# EAGLE design mb_01 (EAGLE 7.7.0)

## Sheet 1 of 6
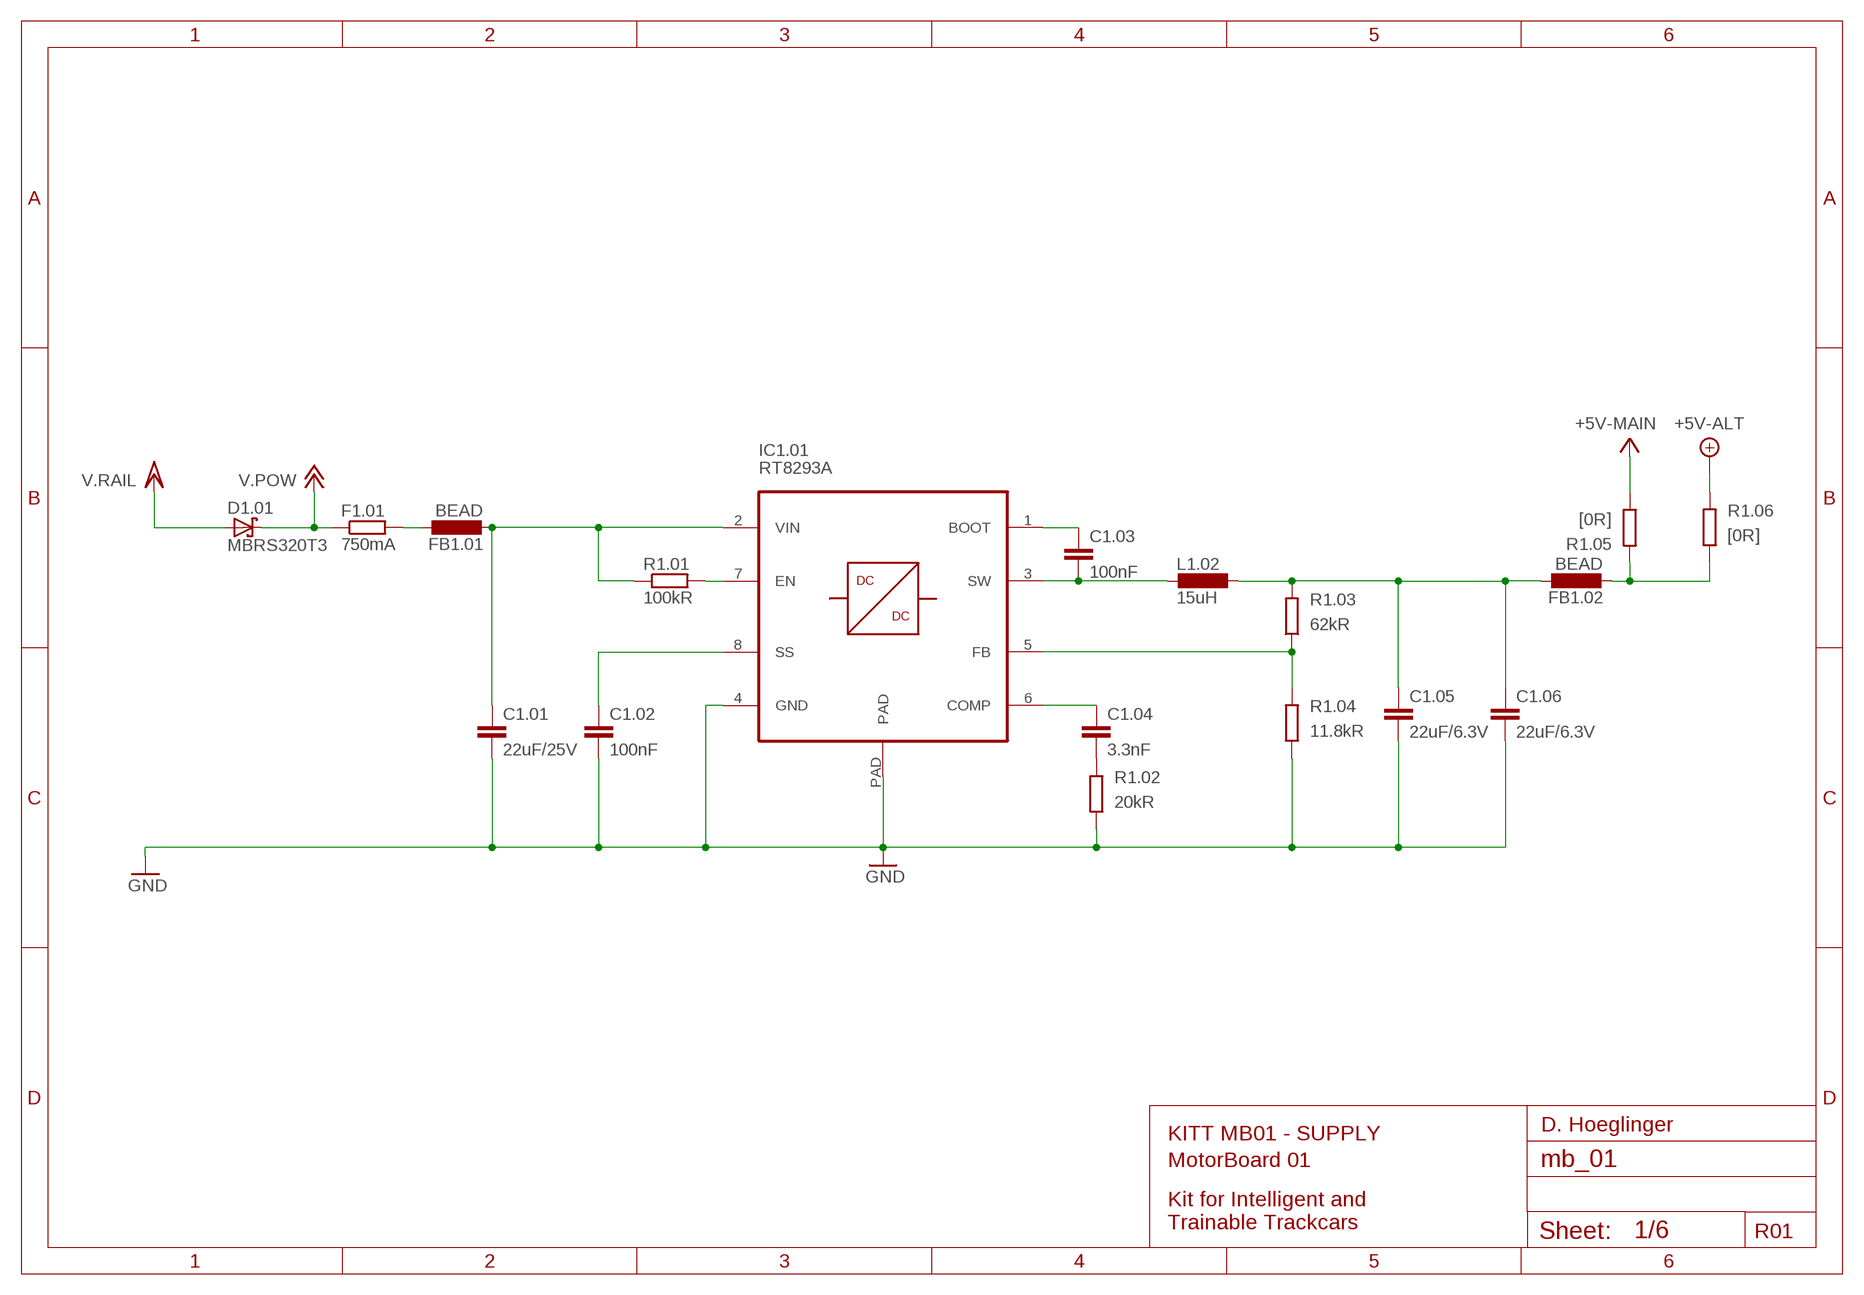
[diagram p0: schematic, sheet 1]

### Parts
C1.01  22uF/25V  C-EUC1210K  [C1210K]
C1.02  100nF  C-EUC0402K  [C0402K]
C1.03  100nF  C-EUC0402K  [C0402K]
C1.04  3.3nF  C-EUC0402K  [C0402K]
C1.05  22uF/6.3V  C-EUC1206K  [C1206K]
C1.06  22uF/6.3V  C-EUC1206K  [C1206K]
D1.01  MBRS320T3  [SMC]
F1.01  750mA  R-EU_R1210  [R1210]
FB1.01  BEAD  L-EUL4516C  [L4516C]
FB1.02  BEAD  L-EUL4516C  [L4516C]
IC1.01  RT8293A  [SOIC-8-PAD]
L1.02  15uH  NRS8030XX  [TAIYO-YUDEN.NRS8030T4R7MJGJ]
R1.01  100kR  R-EU_R0402  [R0402]
R1.02  20kR  R-EU_R0402  [R0402]
R1.03  62kR  R-EU_R0402  [R0402]
R1.04  11.8kR  R-EU_R0402  [R0402]
R1.05  [0R]  R-EU_R0402  [R0402]
R1.06  [0R]  R-EU_R0402  [R0402]

### Nets
+5V: R1.05.1 R1.06.2 ; supply symbol labelled +5V-MAIN, +5V-ALT ; also sheet 2,4,6
+12V: D1.01.C F1.01.1 ; supply symbol labelled V.POW ; also sheet 4,5
GND: C1.01.2 C1.02.2 C1.05.2 C1.06.2 IC1.01.4(GND) IC1.01.PAD R1.02.1 R1.04.1 ; also sheet 2,3,4,5,6
N$80: F1.01.2 FB1.01.1
N$81: C1.01.1 FB1.01.2 IC1.01.2(VIN) R1.01.1
N$82: IC1.01.7(EN) R1.01.2
N$83: C1.02.1 IC1.01.8(SS)
N$84: C1.04.2 R1.02.2
N$85: C1.04.1 IC1.01.6(COMP)
N$86: IC1.01.5(FB) R1.03.1 R1.04.2
N$87: C1.05.1 C1.06.1 FB1.02.1 L1.02.1 R1.03.2
N$88: C1.03.2 IC1.01.3(SW) L1.02.2
N$89: C1.03.1 IC1.01.1(BOOT)
N$90: FB1.02.2 R1.05.2 R1.06.1
VCC/2: D1.01.A ; supply symbol labelled V.RAIL ; also sheet 4

### Notes on the sheet
- TODO
- TODO
- TODO
- TODO
- TODO
- TODO
- D. Hoeglinger
- KITT MB01 | - SUPPLY
- MotorBoard 01
- Kit for Intelligent and
  Trainable Trackcars
- R01

## Sheet 2 of 6
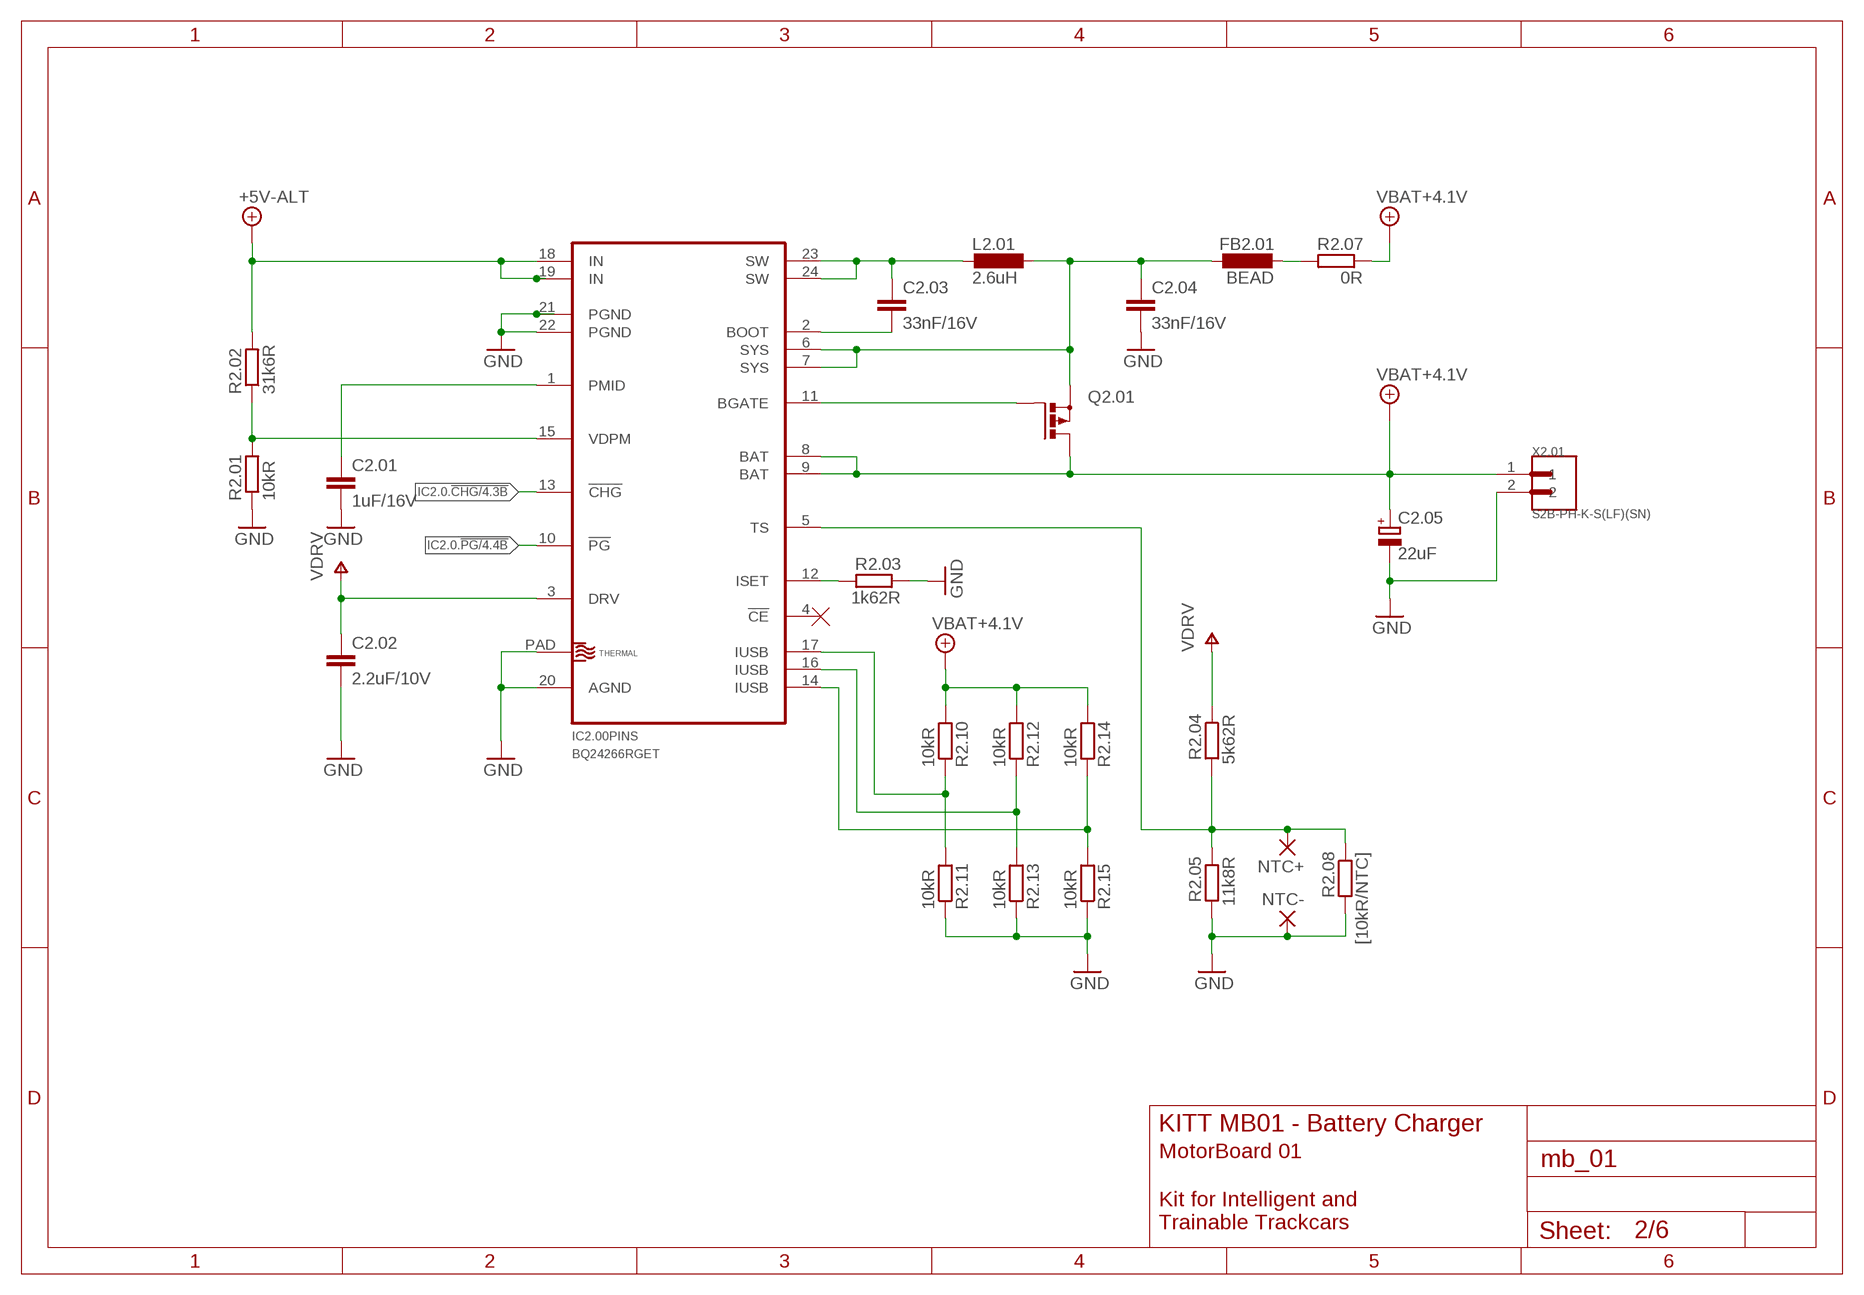
[diagram p1: schematic, sheet 2]

### Parts
C2.01  1uF/16V  C-EUC0805  [C0805]
C2.02  2.2uF/10V  C-EUC0603K  [C0603K]
C2.03  33nF/16V  C-EUC0603  [C0603]
C2.04  33nF/16V  C-EUC0805  [C0805]
C2.05  22uF  CPOL-EUA/3216-18R  [A/3216-18R]
FB2.01  BEAD  L-EUL4516C  [L4516C]
IC2.00  BQ24266RGET  [VQFN-24]
L2.01  2.6uH  NRS8030XX  [TAIYO-YUDEN.NRS8030T4R7MJGJ]
NTC+  SMD2  [SMD1,27-2,54]
NTC-  SMD2  [SMD1,27-2,54]
Q2.01  P-MOSFET-SO8  [SO-08]
R2.01  10kR  R-EU_R0402  [R0402]
R2.02  31k6R  R-EU_R0402  [R0402]
R2.03  1k62R  R-EU_R0402  [R0402]
R2.04  5k62R  R-EU_R0402  [R0402]
R2.05  11k8R  R-EU_R0402  [R0402]
R2.07  0R  R-EU_R0402  [R0402]
R2.08  [10kR/NTC]  R-EU_R0402  [R0402]
R2.10  10kR  R-EU_R0402  [R0402]
R2.11  10kR  R-EU_R0402  [R0402]
R2.12  10kR  R-EU_R0402  [R0402]
R2.13  10kR  R-EU_R0402  [R0402]
R2.14  10kR  R-EU_R0402  [R0402]
R2.15  10kR  R-EU_R0402  [R0402]
X2.01  S2B-PH-K-S(LF)(SN)  [JST_S2B-PH-K-S(LF)(SN)]

### Nets
+4.1V: C2.05.+ IC2.00.8(PINS:BAT) IC2.00.9(PINS:BAT) Q2.01.5(D) Q2.01.6(D) Q2.01.7(D) Q2.01.8(D) R2.07.1 R2.10.2 R2.12.2 R2.14.2 X2.01.1 ; supply symbol labelled VBAT+4.1V ; also sheet 6
+5V: IC2.00.18(PINS:IN) IC2.00.19(PINS:IN) R2.02.2 ; supply symbol labelled +5V-ALT ; also sheet 1,4,6
GND: C2.01.2 C2.02.2 C2.04.2 C2.05.- IC2.00.20(PINS:AGND) IC2.00.21(PINS:PGND) IC2.00.22(PINS:PGND) IC2.00.PAD(PAD:THERMAL) NTC-.1(P) R2.01.1 R2.03.1 R2.05.2 R2.08.2 R2.11.1 R2.13.1 R2.15.1 X2.01.2 ; also sheet 1,3,4,5,6
IC2.0.!CHG: IC2.00.13(PINS:!CHG) ; also sheet 4
IC2.0.!PG: IC2.00.10(PINS:!PG) ; also sheet 4
N$8: C2.01.1 IC2.00.1(PINS:PMID)
N$11: IC2.00.15(PINS:VDPM) R2.01.2 R2.02.1
N$12: C2.03.1 IC2.00.23(PINS:SW) IC2.00.24(PINS:SW) L2.01.2
N$13: C2.03.2 IC2.00.2(PINS:BOOT)
N$14: IC2.00.11(PINS:BGATE) Q2.01.4(G)
N$15: IC2.00.5(PINS:TS) NTC+.1(P) R2.04.2 R2.05.1 R2.08.1
N$16: FB2.01.2 R2.07.2
N$18: C2.04.1 FB2.01.1 IC2.00.6(PINS:SYS) IC2.00.7(PINS:SYS) L2.01.1 Q2.01.1(S) Q2.01.2(S) Q2.01.3(S)
N$19: IC2.00.12(PINS:ISET) R2.03.2
N$20: IC2.00.17(PINS:IUSB) R2.10.1 R2.11.2
N$21: IC2.00.16(PINS:IUSB) R2.12.1 R2.13.2
N$22: IC2.00.14(PINS:IUSB) R2.14.1 R2.15.2
V+: C2.02.1 IC2.00.3(PINS:DRV) R2.04.1 ; supply symbol labelled VDRV
Unconnected: IC2.00.4(PINS:!CE)

### Notes on the sheet
- KITT MB01 - Battery Charger
- MotorBoard 01
- Kit for Intelligent and
  Trainable Trackcars

## Sheet 3 of 6
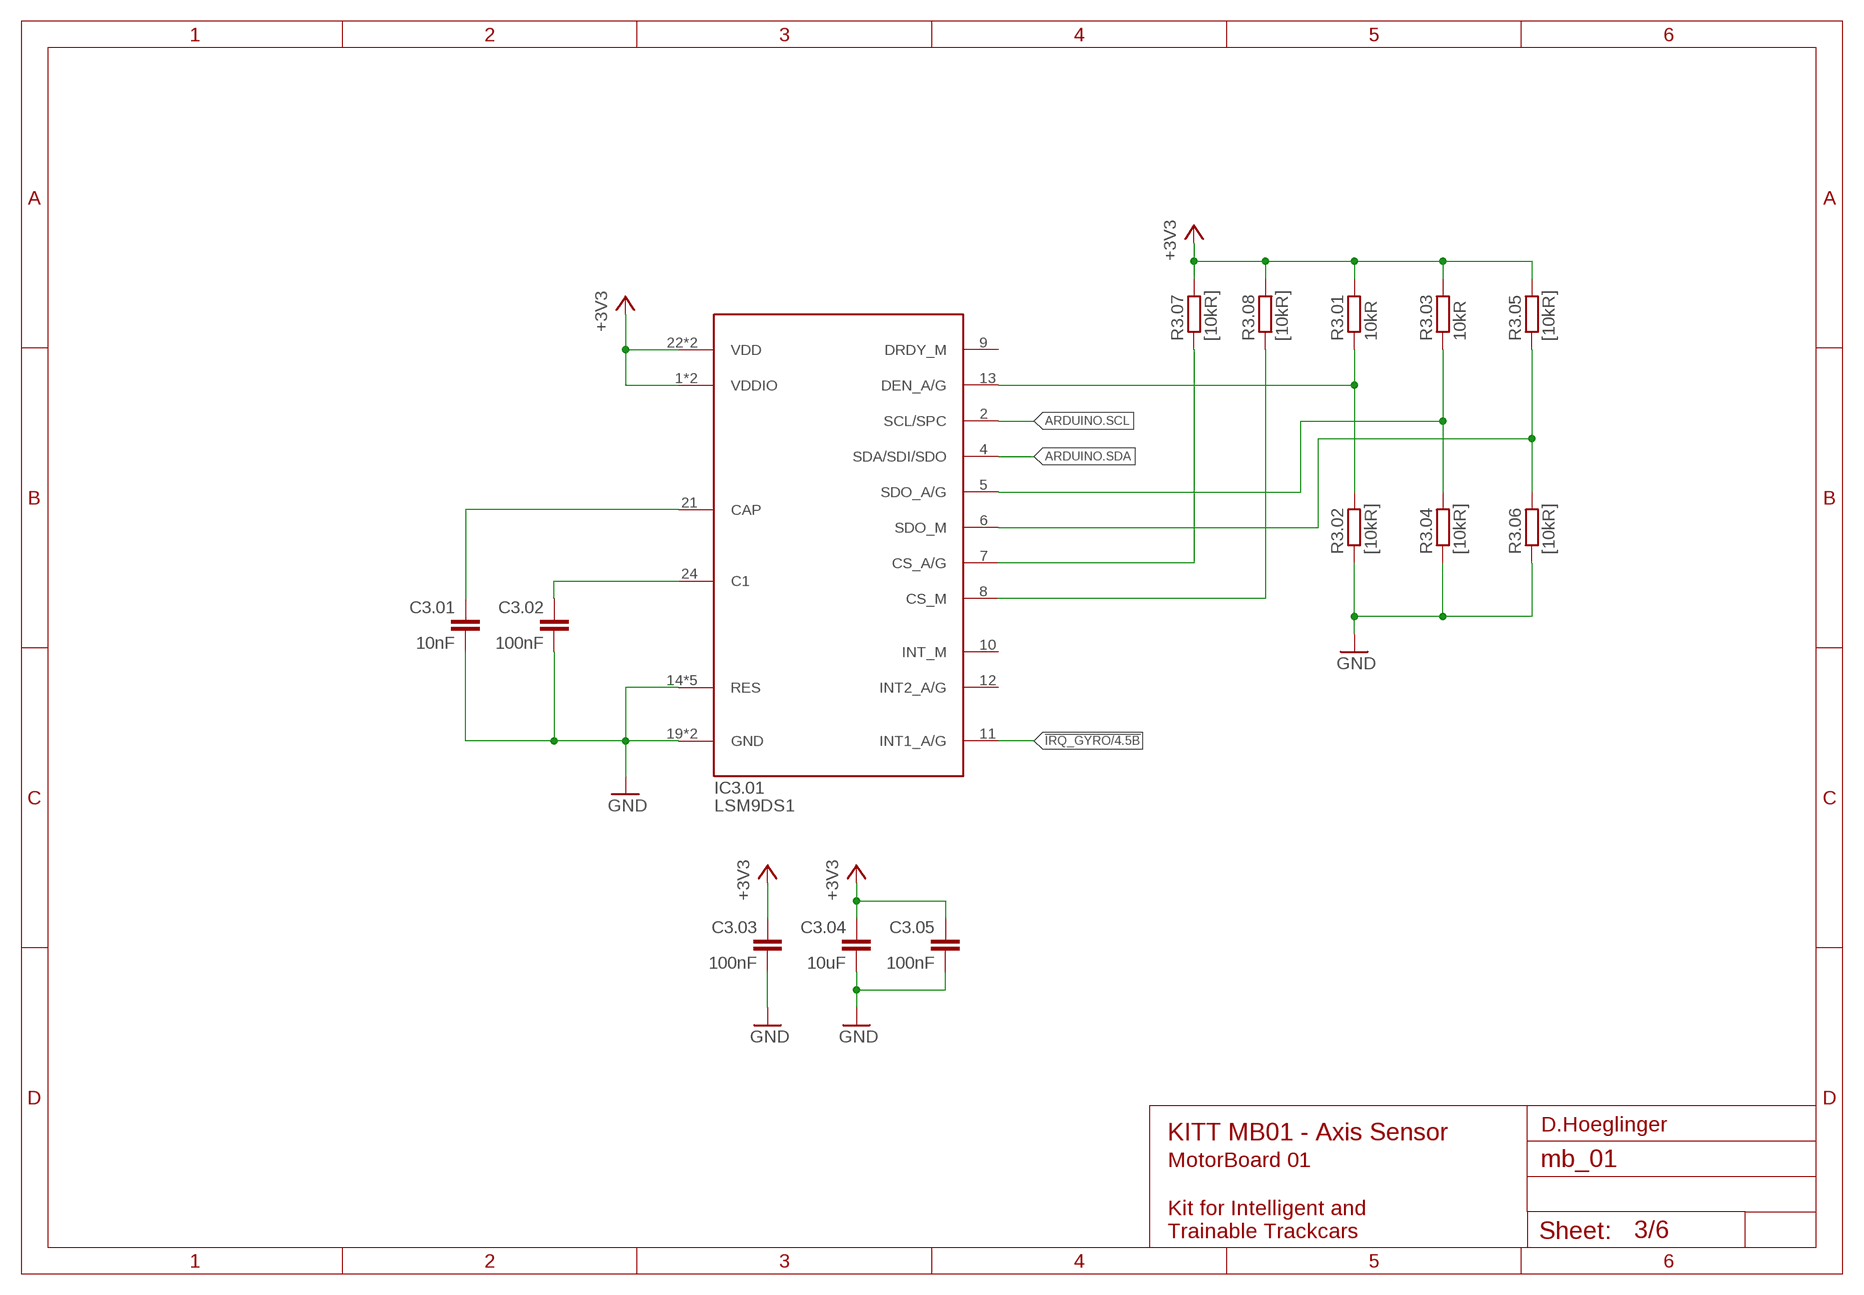
[diagram p2: schematic, sheet 3]

### Parts
C3.01  10nF  C-EUC0603  [C0603]
C3.02  100nF  C-EUC0402  [C0402]
C3.03  100nF  C-EUC0402  [C0402]
C3.04  10uF  C-EUC0603K  [C0603K]
C3.05  100nF  C-EUC0402  [C0402]
IC3.01  LSM9DS1  [LGA-24]
R3.01  10kR  R-EU_R0402  [R0402]
R3.02  [10kR]  R-EU_R0402  [R0402]
R3.03  10kR  R-EU_R0402  [R0402]
R3.04  [10kR]  R-EU_R0402  [R0402]
R3.05  [10kR]  R-EU_R0402  [R0402]
R3.06  [10kR]  R-EU_R0402  [R0402]
R3.07  [10kR]  R-EU_R0402  [R0402]
R3.08  [10kR]  R-EU_R0402  [R0402]

### Nets
!IRQ_GYRO: IC3.01.11(INT1_A/G) ; also sheet 4
+3V3: C3.03.1 C3.04.1 C3.05.1 IC3.01.1(VDDIO) IC3.01.3(VDDIO) IC3.01.22(VDD) IC3.01.23(VDD) R3.01.2 R3.03.2 R3.05.2 R3.07.2 R3.08.2 ; also sheet 4,6
ARDUINO.SCL: IC3.01.2(SCL/SPC)
ARDUINO.SDA: IC3.01.4(SDA/SDI/SDO)
GND: C3.01.2 C3.02.2 C3.03.2 C3.04.2 C3.05.2 IC3.01.14(RES) IC3.01.15(RES) IC3.01.16(RES) IC3.01.17(RES) IC3.01.18(RES) IC3.01.19(GND) IC3.01.20(GND) R3.02.1 R3.04.1 R3.06.1 ; also sheet 1,2,4,5,6
N$1: C3.01.1 IC3.01.21(CAP)
N$6: C3.02.1 IC3.01.24(C1)
N$17: IC3.01.13(DEN_A/G) R3.01.1 R3.02.2
N$23: IC3.01.5(SDO_A/G) R3.03.1 R3.04.2
N$24: IC3.01.7(CS_A/G) R3.07.1
N$26: IC3.01.6(SDO_M) R3.05.1 R3.06.2
N$27: IC3.01.8(CS_M) R3.08.1
Unconnected: IC3.01.9(DRDY_M) IC3.01.10(INT_M) IC3.01.12(INT2_A/G)

### Notes on the sheet
- D.Hoeglinger
- KITT MB01 - Axis Sensor
- MotorBoard 01
- Kit for Intelligent and
  Trainable Trackcars

## Sheet 4 of 6
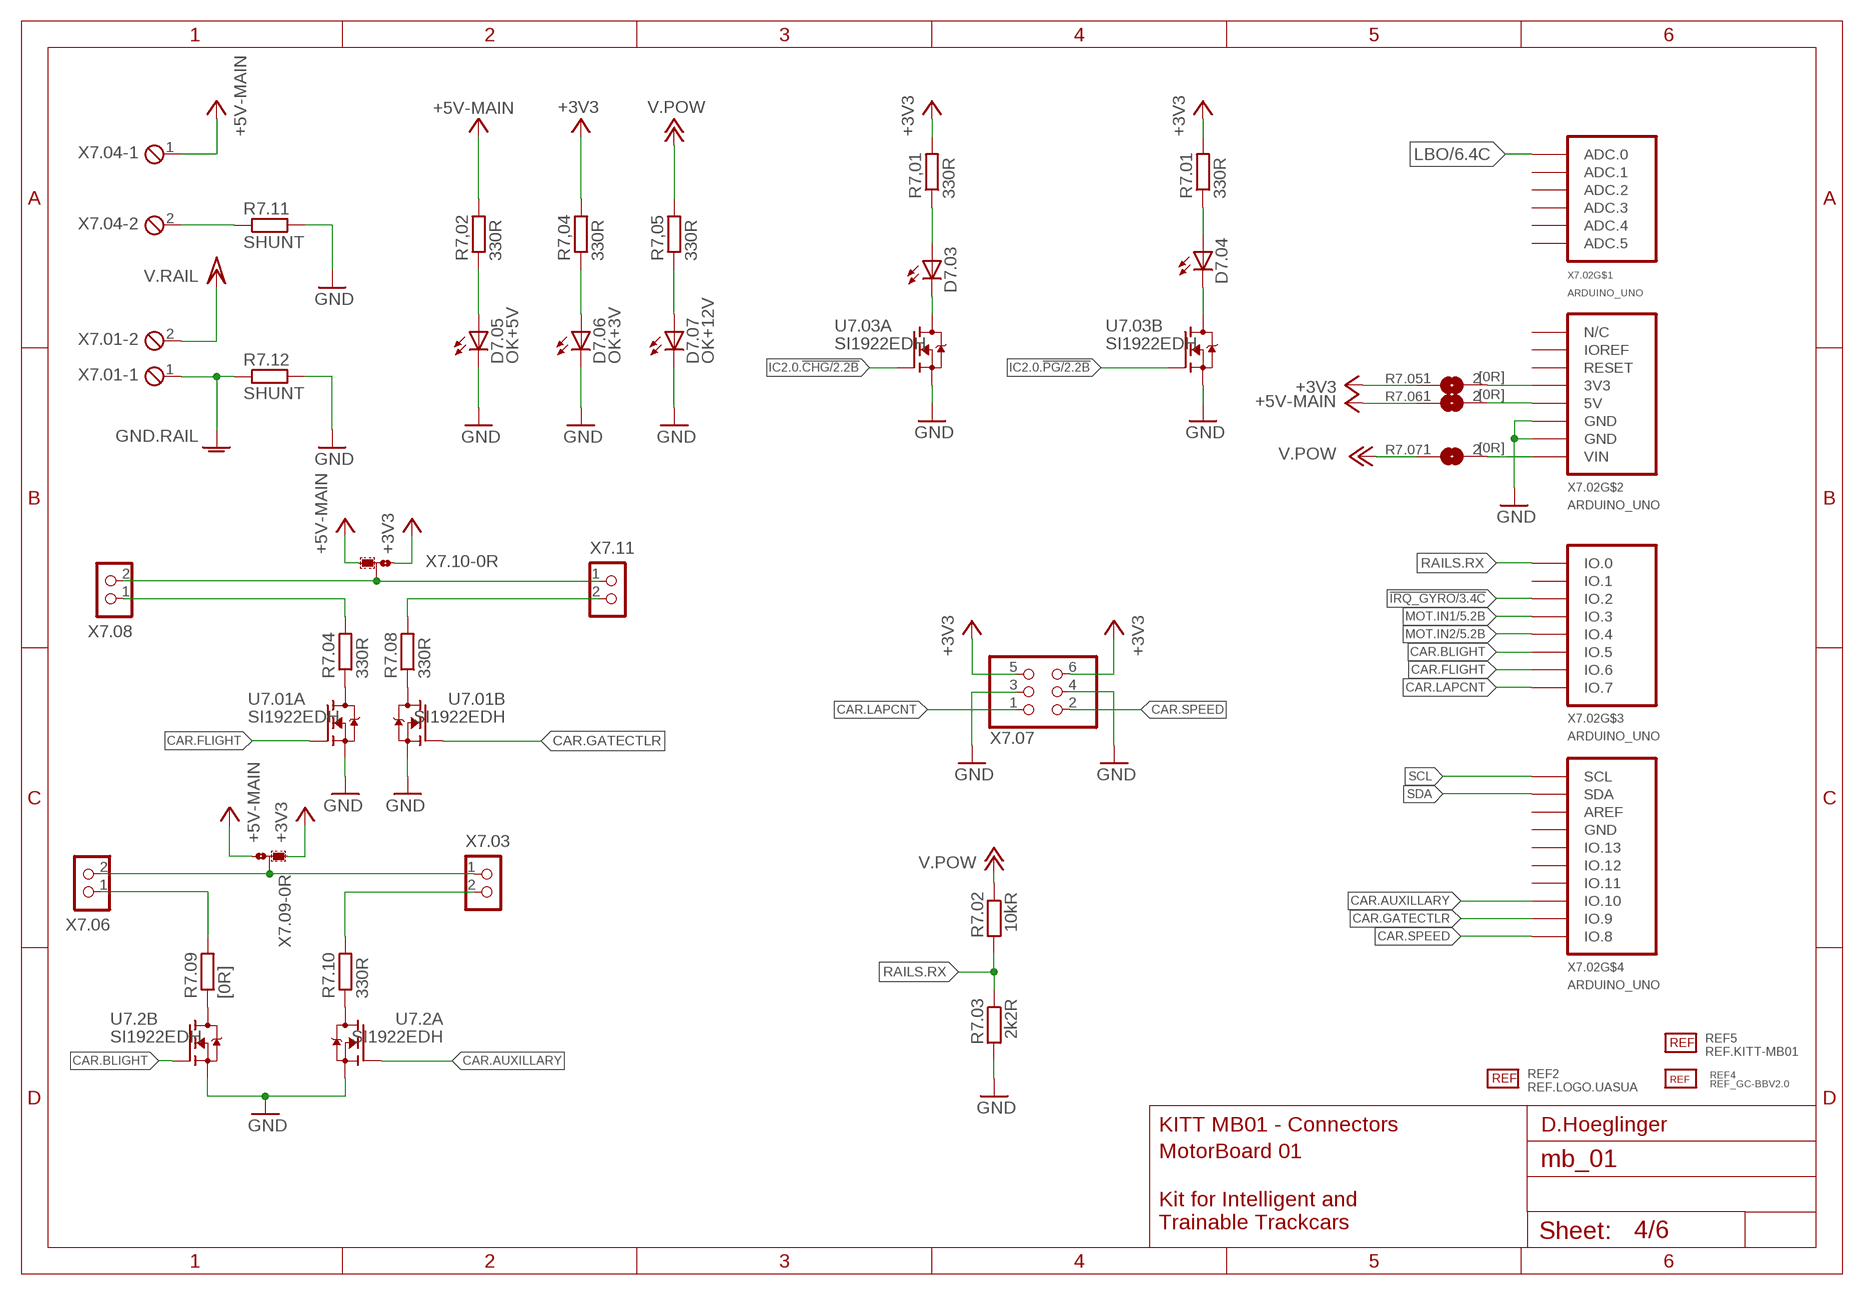
[diagram p3: schematic, sheet 4]

### Parts
D7.03  LEDCHIPLED_1206  [CHIPLED_1206]
D7.04  LEDCHIPLED_1206  [CHIPLED_1206]
D7.05  OK+5V  LEDCHIPLED_1206  [CHIPLED_1206]
D7.06  OK+3V  LEDCHIPLED_1206  [CHIPLED_1206]
D7.07  OK+12V  LEDCHIPLED_1206  [CHIPLED_1206]
R7,01  330R  R-EU_R0603  [R0603]
R7,02  330R  R-EU_R0603  [R0603]
R7,04  330R  R-EU_R0603  [R0603]
R7,05  330R  R-EU_R0603  [R0603]
R7.01  330R  R-EU_R0603  [R0603]
R7.02  10kR  R-EU_M0805  [M0805]
R7.03  2k2R  R-EU_M0805  [M0805]
R7.04  330R  R-EU_R0603  [R0603]
R7.05  [0R]  SJ  [SJ]
R7.06  [0R]  SJ  [SJ]
R7.07  [0R]  SJ  [SJ]
R7.08  330R  R-EU_R0603  [R0603]
R7.09  [0R]  R-EU_R0603  [R0603]
R7.10  330R  R-EU_R0603  [R0603]
R7.11  SHUNT  R-EU_R1206  [R1206]
R7.12  SHUNT  R-EU_R1206  [R1206]
REF2  REF.LOGO.UASUA  [REF_LOGO_UASUA]
REF4  REF_GC-BBV2.0  [REF_GHOSTCAR]
REF5  REF.KITT-MB01  [REF_KITT_MB01]
U7.01  SI1922EDH  [SC70-6]
U7.2  SI1922EDH  [SC70-6]
U7.03  SI1922EDH  [SC70-6]
X7.01  MPT2  [2POL254]
X7.02  ARDUINO_UNO  [AU_PINS]
X7.03  CON_HEADER_1X02  [M1X2_MALE_RIGHT_ANGLED_SMD]
X7.04  MPT2  [2POL254]
X7.06  CON_HEADER_1X02  [M1X2_MALE_RIGHT_ANGLED_SMD]
X7.07  PINHD-2X3/90  [2X03/90]
X7.08  CON_HEADER_1X02  [M1X2_MALE_RIGHT_ANGLED_SMD]
X7.09  0R-JUMPA  [A0R-JMP]
X7.10  0R-JUMPA  [A0R-JMP]
X7.11  CON_HEADER_1X02  [M1X2_MALE_RIGHT_ANGLED_SMD]

### Nets
!IRQ_GYRO: X7.02.IO.2 ; also sheet 3
+3V3: R7,01.2 R7,04.2 R7.01.2 R7.05.1 X7.07.5 X7.07.6 X7.09.1 X7.10.1 ; also sheet 3,6
+5V: R7,02.2 R7.06.1 X7.04.1 X7.09.3 X7.10.3 ; supply symbol labelled +5V-MAIN ; also sheet 1,2,6
+12V: R7,05.2 R7.02.1 R7.07.1 ; supply symbol labelled V.POW ; also sheet 1,5
CAR.AUXILLARY: U7.2.2(A:G) X7.02.IO.10
CAR.BLIGHT: U7.2.5(B:G) X7.02.IO.5
CAR.FLIGHT: U7.01.2(A:G) X7.02.IO.6
CAR.GATECTLR: U7.01.5(B:G) X7.02.IO.9
CAR.LAPCNT: X7.02.IO.7 X7.07.1
CAR.SPEED: X7.02.IO.8 X7.07.2
GND: D7.05.C D7.06.C D7.07.C R7.03.2 R7.11.2 R7.12.2 U7.01.1(A:S) U7.01.4(B:S) U7.2.1(A:S) U7.2.4(B:S) U7.03.1(A:S) U7.03.4(B:S) X7.02.GND2(GND) X7.02.GND3(GND) X7.07.3 X7.07.4 ; also sheet 1,2,3,5,6
GNDA: R7.12.1 X7.01.1 ; supply symbol labelled GND.RAIL
IC2.0.!CHG: U7.03.2(A:G) ; also sheet 2
IC2.0.!PG: U7.03.5(B:G) ; also sheet 2
LBO: X7.02.ADC.0 ; also sheet 6
MOT.IN1: X7.02.IO.3 ; also sheet 5
MOT.IN2: X7.02.IO.4 ; also sheet 5
N$2: R7.04.1 U7.01.6(A:D)
N$3: R7.05.2 X7.02.3.3V(3V3)
N$4: R7.06.2 X7.02.5V
N$5: R7.07.2 X7.02.VIN
N$7: R7.08.1 U7.01.3(B:D)
N$25: R7.11.1 X7.04.2
N$28: D7.03.C U7.03.6(A:D)
N$29: D7.03.A R7,01.1
N$30: D7.04.A R7.01.1
N$31: D7.04.C U7.03.3(B:D)
N$32: D7.05.A R7,02.1
N$38: D7.06.A R7,04.1
N$42: R7.04.2 X7.08.1
N$44: D7.07.A R7,05.1
N$45: X7.08.2 X7.10.2 X7.11.1
N$46: R7.09.2 X7.06.1
N$47: R7.09.1 U7.2.3(B:D)
N$48: X7.03.1 X7.06.2 X7.09.2
N$50: R7.08.2 X7.11.2
N$51: R7.10.1 U7.2.6(A:D)
N$52: R7.10.2 X7.03.2
RAILS.RX: R7.02.2 R7.03.1 X7.02.IO.0
SCL: X7.02.SCL
SDA: X7.02.SDA
VCC/2: X7.01.2 ; supply symbol labelled V.RAIL ; also sheet 1
Unconnected: X7.02.ADC.1 X7.02.ADC.2 X7.02.ADC.3 X7.02.ADC.4 X7.02.ADC.5 X7.02.AREF X7.02.GND.1(GND) X7.02.I/OREF(IOREF) X7.02.IO.1 X7.02.IO.11 X7.02.IO.12 X7.02.IO.13 X7.02.N/C X7.02.RESET

### Notes on the sheet
- KITT MB01 - Connectors | D.Hoeglinger
- MotorBoard 01
- Kit for Intelligent and
  Trainable Trackcars

## Sheet 5 of 6
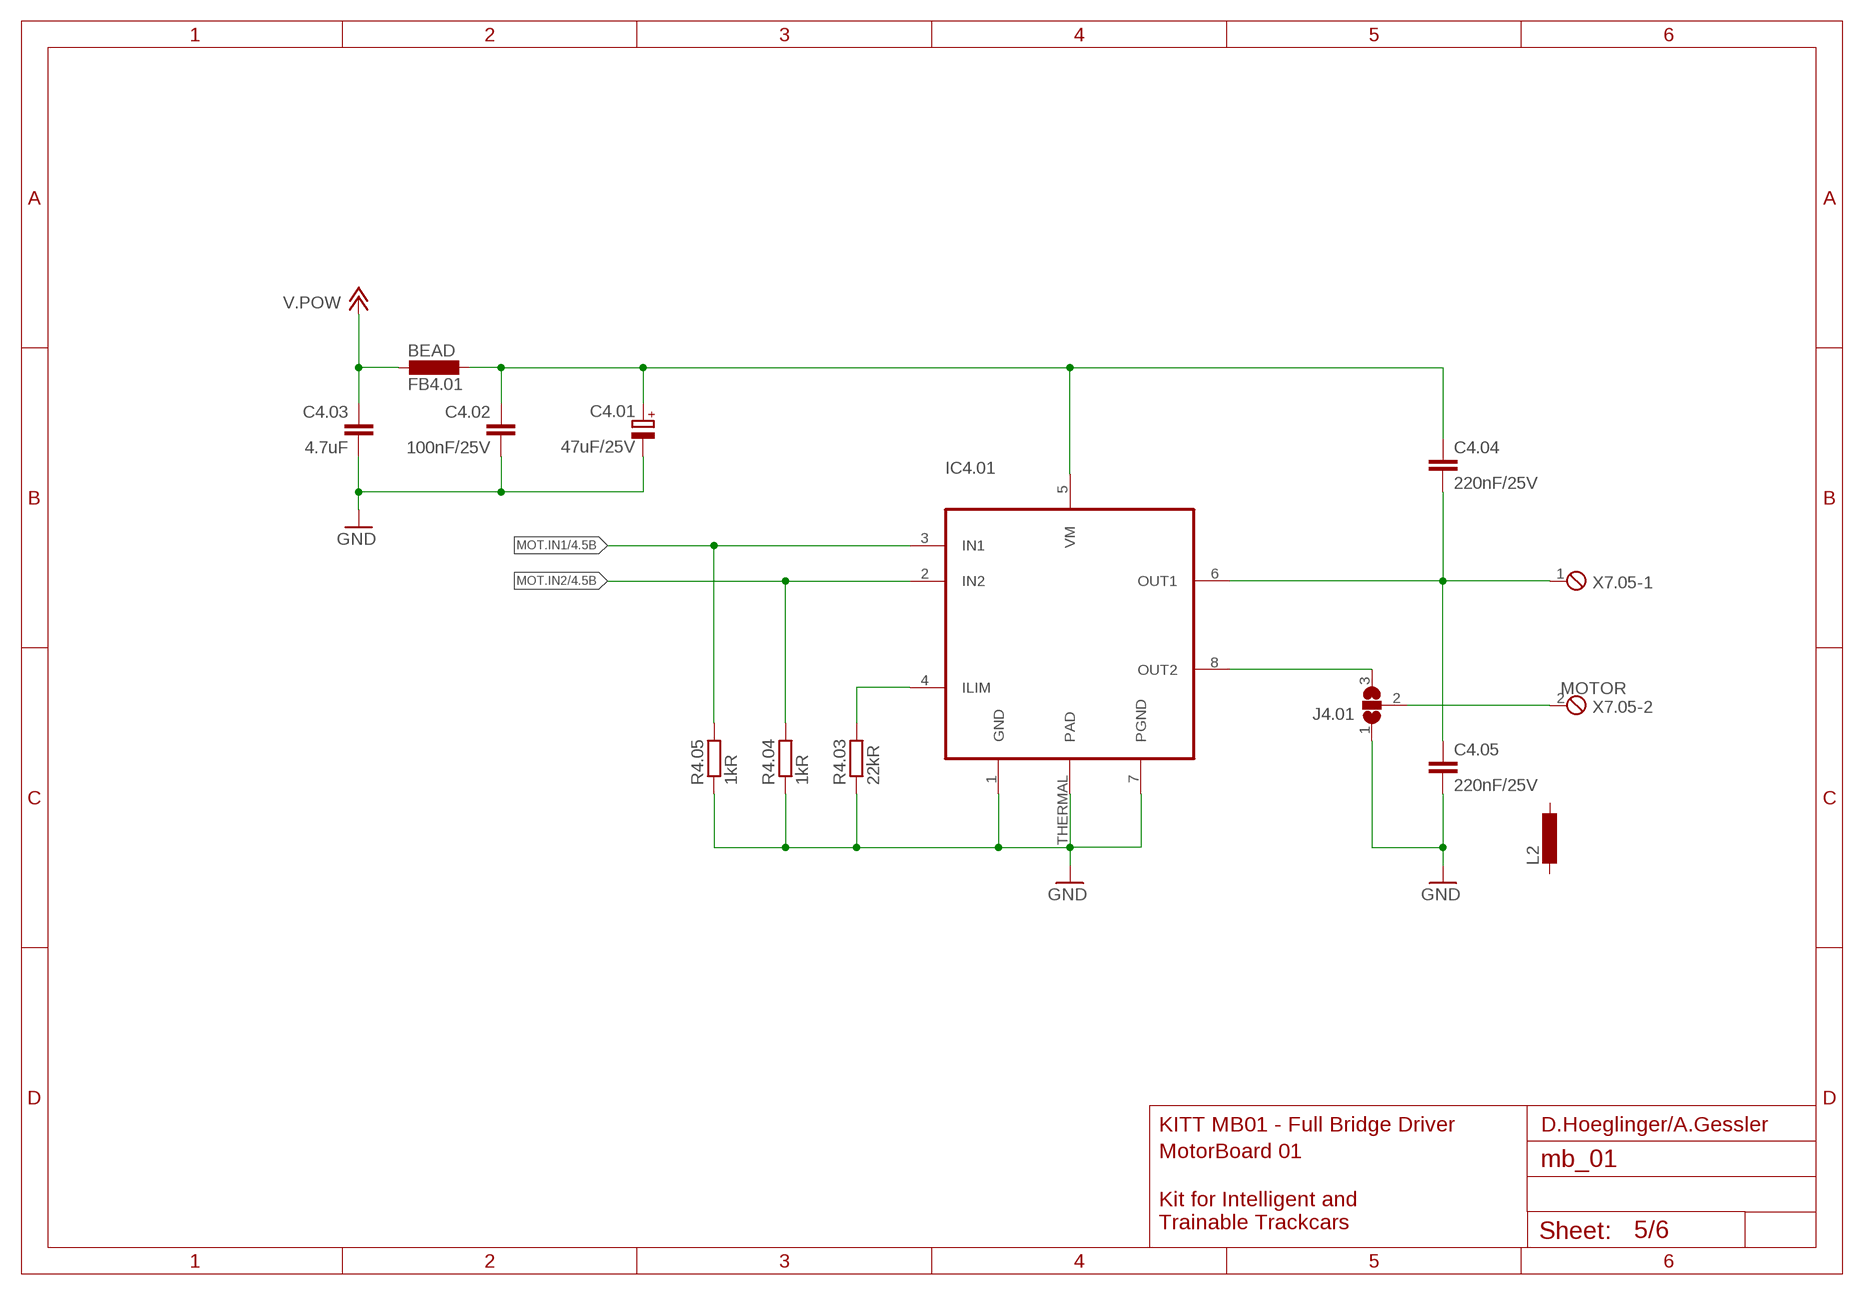
[diagram p4: schematic, sheet 5]

### Parts
C4.01  47uF/25V  CPOL-EUC/6032-28R  [C/6032-28R]
C4.02  100nF/25V  C-EUC0603K  [C0603K]
C4.03  4.7uF  C-EUC0805K  [C0805K]
C4.04  220nF/25V  C-EUC0603K  [C0603K]
C4.05  220nF/25V  C-EUC0603K  [C0603K]
FB4.01  BEAD  L-EUL4516C  [L4516C]
IC4.01  DRV8871  [HSOP8]
J4.01  SJ2W  [SJ_2]
L2  L-EUL4516C  [L4516C]
R4.03  22kR  R-EU_R0402  [R0402]
R4.04  1kR  R-EU_R0402  [R0402]
R4.05  1kR  R-EU_R0402  [R0402]
X7.05  MOTOR  MPT2  [2POL254]

### Nets
+12V: C4.03.1 FB4.01.2 ; supply symbol labelled V.POW ; also sheet 1,4
GND: C4.01.- C4.02.2 C4.03.2 C4.05.2 IC4.01.1(GND) IC4.01.7(PGND) IC4.01.THERMAL(PAD) J4.01.1 R4.03.1 R4.04.1 R4.05.1 ; also sheet 1,2,3,4,6
MOT.IN1: IC4.01.3(IN1) R4.05.2 ; also sheet 4
MOT.IN2: IC4.01.2(IN2) R4.04.2 ; also sheet 4
N$9: J4.01.2 X7.05.2
N$10: C4.01.+ C4.02.1 C4.04.1 FB4.01.1 IC4.01.5(VM)
N$33: C4.04.2 C4.05.1 IC4.01.6(OUT1) X7.05.1
N$34: IC4.01.8(OUT2) J4.01.3
N$35: IC4.01.4(ILIM) R4.03.2
Unconnected: L2.1 L2.2

### Notes on the sheet
- KITT MB01 - Full Bridge Driver | D.Hoeglinger/A.Gessler
- MotorBoard 01
- Kit for Intelligent and
  Trainable Trackcars

## Sheet 6 of 6
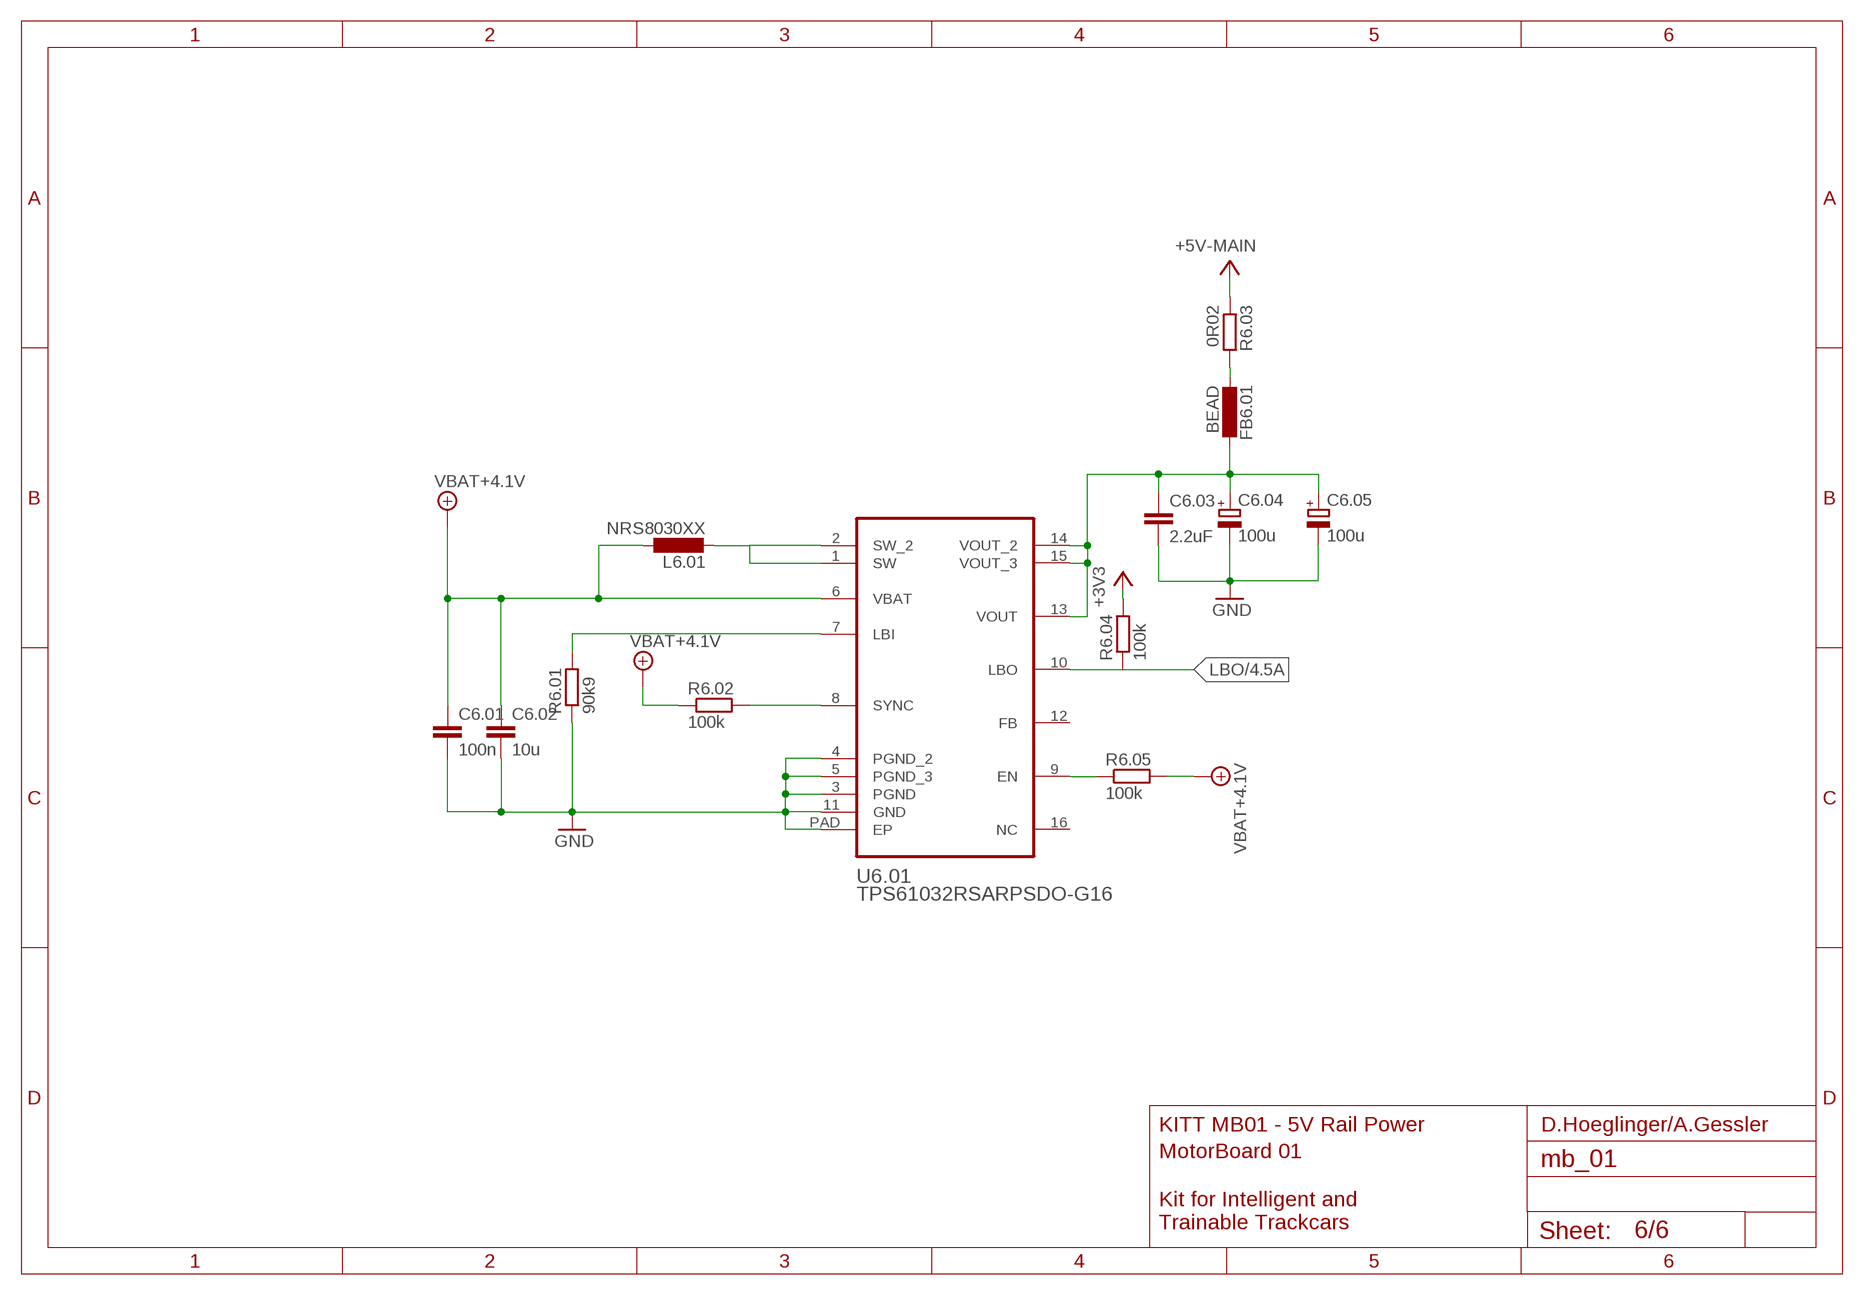
[diagram p5: schematic, sheet 6]

### Parts
C6.01  100n  C-EUC0402  [C0402]
C6.02  10u  C-EUC0603  [C0603]
C6.03  2.2uF  C-EUC0603  [C0603]
C6.04  100u  CPOL-29172312  [C-2312]
C6.05  100u  CPOL-29172312  [C-2312]
FB6.01  BEAD  L-EUL4516C  [L4516C]
L6.01  NRS8030XX  [TAIYO-YUDEN.NRS8030T4R7MJGJ]
R6.01  90k9  R-EU_R0402  [R0402]
R6.02  100k  R-EU_R0402  [R0402]
R6.03  0R02  R-EU_R0805  [R0805]
R6.04  100k  R-EU_R0402  [R0402]
R6.05  100k  R-EU_R0402  [R0402]
U6.01  TPS61032RSARPSDO-G16  [R-PDSO-G16]

### Nets
+3V3: R6.04.2 ; also sheet 3,4
+4.1V: C6.01.1 C6.02.1 L6.01.1 R6.02.1 R6.05.2 U6.01.6(VBAT) ; supply symbol labelled VBAT+4.1V ; also sheet 2
+5V: R6.03.1 ; supply symbol labelled +5V-MAIN ; also sheet 1,2,4
GND: C6.01.2 C6.02.2 C6.03.2 C6.04.N(-) C6.05.N(-) R6.01.1 U6.01.3(PGND) U6.01.4(PGND_2) U6.01.5(PGND_3) U6.01.11(GND) U6.01.PAD(EP) ; also sheet 1,2,3,4,5
LBO: R6.04.1 U6.01.10(LBO) ; also sheet 4
N$36: FB6.01.2 R6.03.2
N$37: R6.05.1 U6.01.9(EN)
N$39: L6.01.2 U6.01.1(SW) U6.01.2(SW_2)
N$40: R6.01.2 U6.01.7(LBI)
N$41: R6.02.2 U6.01.8(SYNC)
N$43: C6.03.1 C6.04.P(+) C6.05.P(+) FB6.01.1 U6.01.13(VOUT) U6.01.14(VOUT_2) U6.01.15(VOUT_3)
Unconnected: U6.01.12(FB) U6.01.16(NC)

### Notes on the sheet
- KITT MB01 - 5V Rail Power | D.Hoeglinger/A.Gessler
- MotorBoard 01
- Kit for Intelligent and
  Trainable Trackcars

## Library data of the parts
C1.01-C1.06 C2.01-C2.04 C3.01-C3.03 C3.05 C4.04 C4.05 C6.01-C6.03 = rcl:C-EU: CAPACITOR, European symbol
C2.05 C4.01 = rcl:CPOL-EU: POLARIZED CAPACITOR, European symbol
C3.04 C4.02 C4.03 = resistor:C-EU: CAPACITOR, European symbol
C6.04 C6.05 = kitt.psvs:CPOL-2917
D1.01 = diode:MBRS3*0T3: SCHOTTKY BARRIER RECTIFIER 3.0 AMPERES 20, 30, 40 VOLT Source: MBRS340T3-D.pdf
D7.03-D7.07 = led:LED: LED OSRAM: - CHIPLED LG R971, LG N971, LY N971, LG Q971, LY Q971, LO R971, LY R971 LH N974, LH R974 LS Q976, LO Q976, LY Q976 LO Q996 - Hyper CHIPLED LW Q18S LB Q993, LB Q99A, LB R99A - SideLED LS A670, LO A670, LY A670, LG A670, LP A670 LB A673, LV A673, LT A673, LW A673 LH A674 LY A675 LS A676, LA A676, LO A676, LY A676, LW A676 LS A679, LY A679, LG A679 - Hyper Micro SIDELED® LS Y876, LA Y876, LO Y876, LY Y876 LT Y87S - SmartLED LW L88C, LW L88S LB L89C, LB L89S, LG L890 LS L89K, LO L89K, LY L89K LS L896, LA L896, LO L896, LY L896 - TOPLED LS T670, LO T670, LY T670, LG T670, LP T670 LSG T670, LSP T670, LSY T670, LOP T670, LYG T670 LG T671, LOG T671, LSG T671 LB T673, LV T673, LT T673, LW T673 LH T674 LS T676, LA T676, LO T676, LY T676, LB T676, LH T676, LSB T676, LW T676 LB T67C, LV T67C, LT T67C, LS T67K, LO T67K, LY T67K, LW E67C LS E67B, LA E67B, LO E67B, LY E67B, LB E67C, LV E67C, LT E67C LW T67C LS T679, LY T679, LG T679 LS T770, LO T770, LY T770, LG T770, LP T770 LB T773, LV T773, LT T773, LW T773 LH T774 LS E675, LA E675, LY E675, LS T675 LS T776, LA T776, LO T776, LY T776, LB T776 LHGB T686 LT T68C, LB T68C - Hyper Mini TOPLED® LB M676 - Mini TOPLED Santana® LG M470 LS M47K, LO M47K, LY M47K Source: http://www.osram.convergy.de LUXEON: - LUMILED® LXK2-PW12-R00, LXK2-PW12-S00, LXK2-PW14-U00, LXK2-PW14-V00 LXK2-PM12-R00, LXK2-PM12-S00, LXK2-PM14-U00 LXK2-PE12-Q00, LXK2-PE12-R00, LXK2-PE12-S00, LXK2-PE14-T00, LXK2-PE14-U00 LXK2-PB12-K00, LXK2-PB12-L00, LXK2-PB12-M00, LXK2-PB14-N00, LXK2-PB14-P00, LXK2-PB14-Q00 LXK2-PR12-L00, LXK2-PR12-M00, LXK2-PR14-Q00, LXK2-PR14-R00 LXK2-PD12-Q00, LXK2-PD12-R00, LXK2-PD12-S00 LXK2-PH12-R00, LXK2-PH12-S00 LXK2-PL12-P00, LXK2-PL12-Q00, LXK2-PL12-R00 Source: www.luxeon.com KINGBRIGHT: KA-3528ASYC Source: www.kingbright.com
F1.01 R1.01-R1.06 R2.01-R2.05 R2.07 R2.08 R2.10-R2.15 R3.01-R3.08 R6.01-R6.05 R7,01 R7,02 R7,04 R7,05 R7.01-R7.04 R7.08 R7.09 R7.10-R7.12 = rcl:R-EU_: RESISTOR, European symbol
FB1.01 FB1.02 FB2.01 FB4.01 FB6.01 L2 = rcl:L-EU: INDUCTOR, European symbol
IC1.01 = kitt.ic:RT8293A
IC2.00 = kitt.ic:BQ24266RGET
IC3.01 = kitt.ic:LSM9DS1; AVAILABILITY: Unavailable; DESCRIPTION: iNEMO inertial module: 3D accelerometer, 3D gyroscope, 3D magnetometer; MF: STMicroelectronics; MP: LSM9DS1; PACKAGE: None; PRICE: None
IC4.01 = kitt.ic:DRV8871
J4.01 = jumper:SJ2W: SMD solder JUMPER
L1.02 L2.01 L6.01 = kitt.psvs:NRS8030XX
NTC+ NTC- = wirepad:SMD2: SMD PAD
Q2.01 = transistor-power:P-MOSFET-SO8: P-Channel MOSFET Example: FDS4435A; P-Channel Logic Level PowerTrench® MOSFET FDS4465; P-Channel 1.8V Specified PowerTrench® MOSFET Source: www.fairchildsemi.com
R4.03-R4.05 = resistor:R-EU_: RESISTOR, European symbol
R7.05-R7.07 = jumper:SJ: SMD solder JUMPER
REF2 = kitt.refs:REF.LOGO.UASUA
REF4 = kitt.con:REF_GC-BBV2.0
REF5 = kitt.refs:REF.KITT-MB01
U6.01 = kitt.ic:TPS61032RSAR: SYNCHRONOUS BOOST CONVERTER
U7.01 U7.2 U7.03 = kitt.ic:SI1922EDH
X2.01 = kitt.con:S2B-PH-K-S(LF)(SN): PH Series 2 Position 2.0 mm Through Hole Side Entry Shrouded Header; AVAILABILITY: Good; DESCRIPTION: PH Series 2 Position 2.0 mm Through Hole Side Entry Shrouded Header; MF: JST; MP: S2B-PH-K-S(LF)(SN); PACKAGE: FakePackage u; PRICE: 0.08 USD
X7.01 X7.04 X7.05 = con-phoenix-254:MPT2: PHOENIX CONNECTOR; OC_FARNELL: unknown; OC_NEWARK: unknown
X7.02 = kitt.con:ARDUINO_UNO
X7.03 X7.06 X7.08 X7.11 = kitt.con:CON_HEADER_1X02
X7.07 = pinhead:PINHD-2X3: PIN HEADER
X7.09 X7.10 = jump-0r-smd:0R-JUMP: SMD 0R 0805 Jumper

## Board
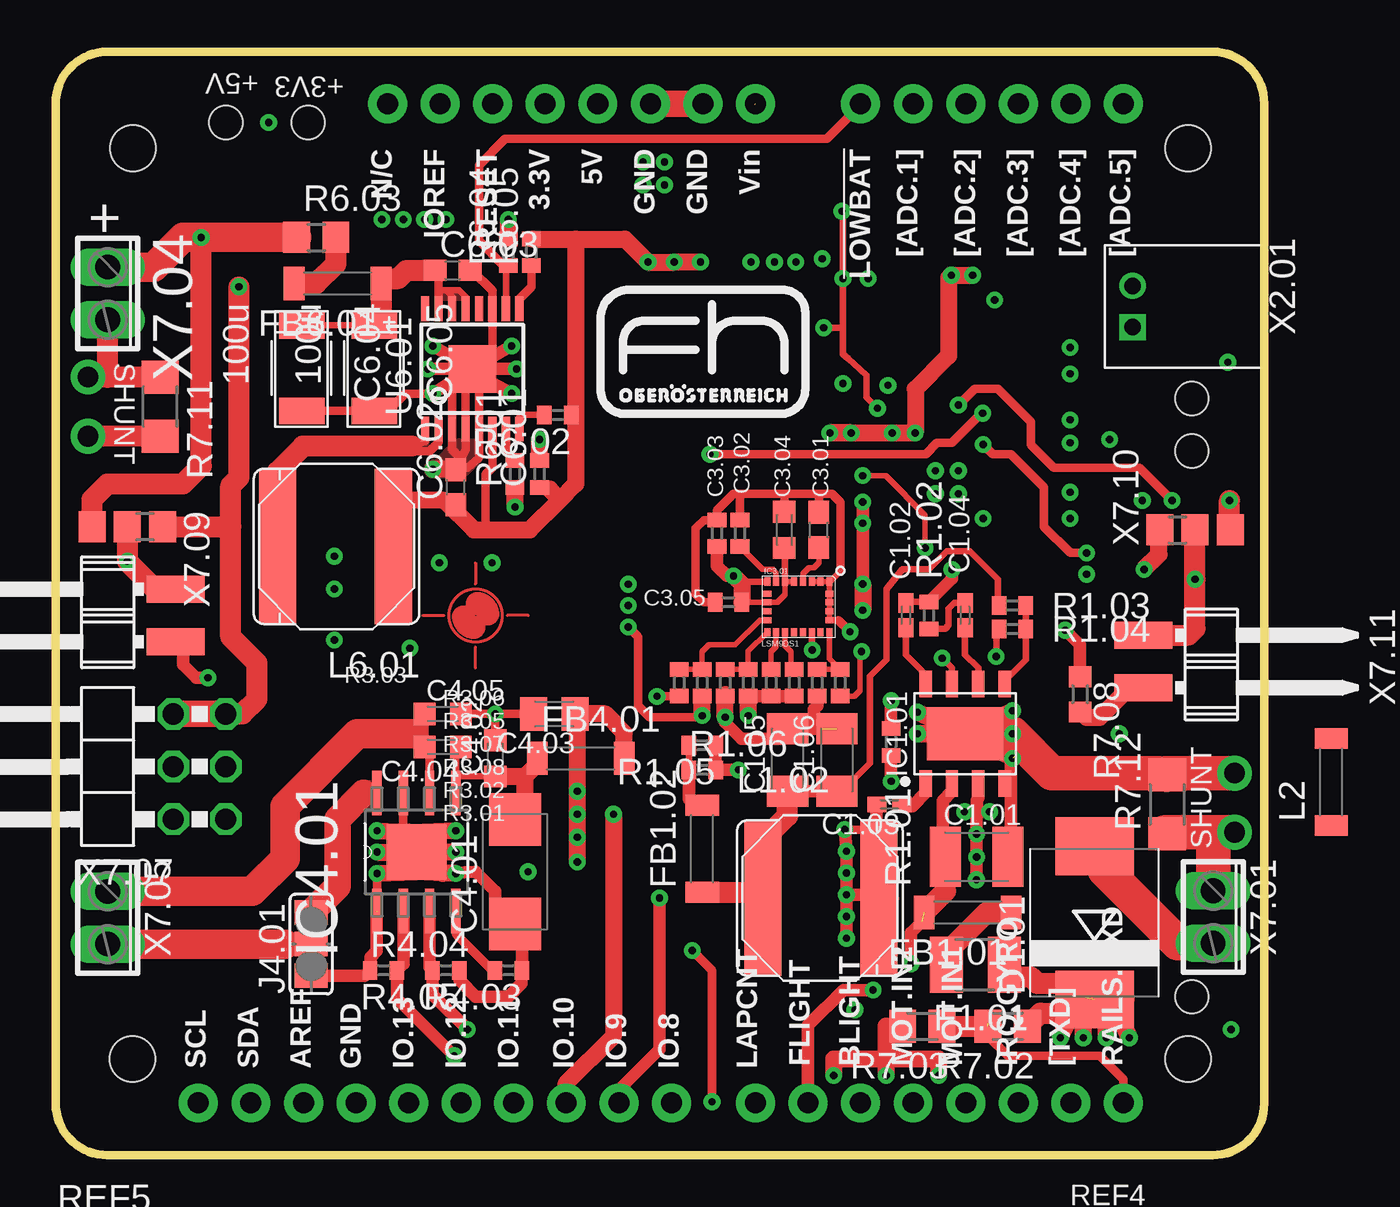
[diagram p6: board, top side]
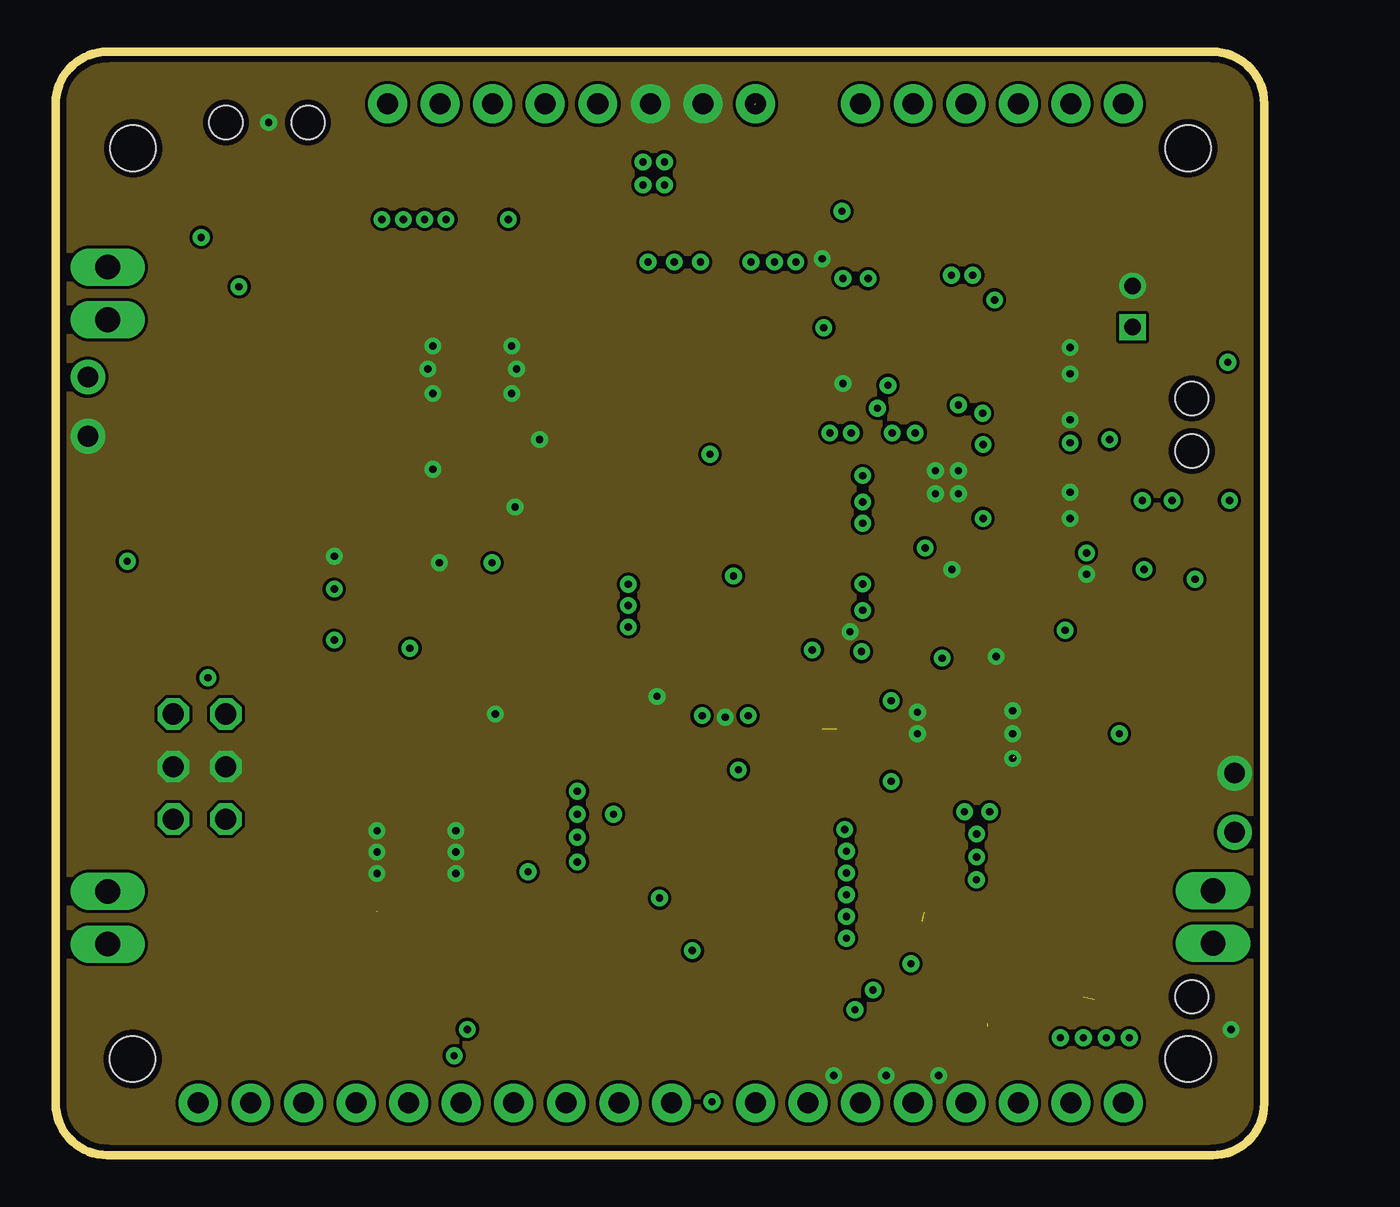
[diagram p7: board, inner layer Route2]
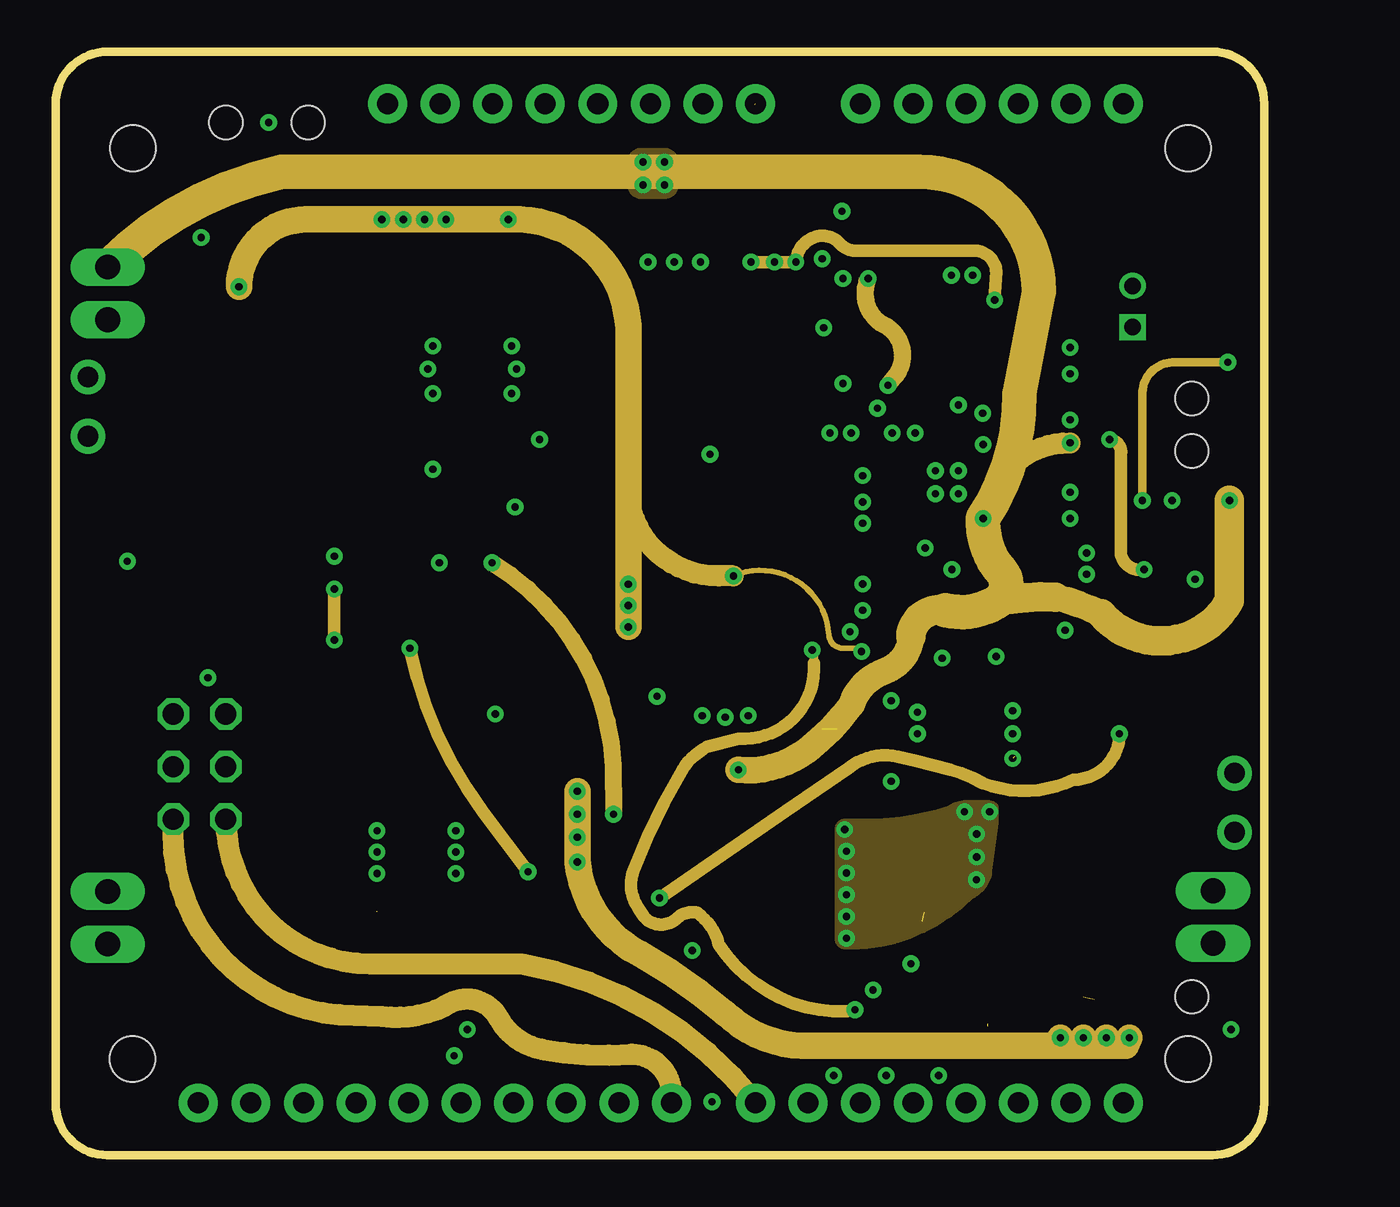
[diagram p8: board, inner layer Route3]
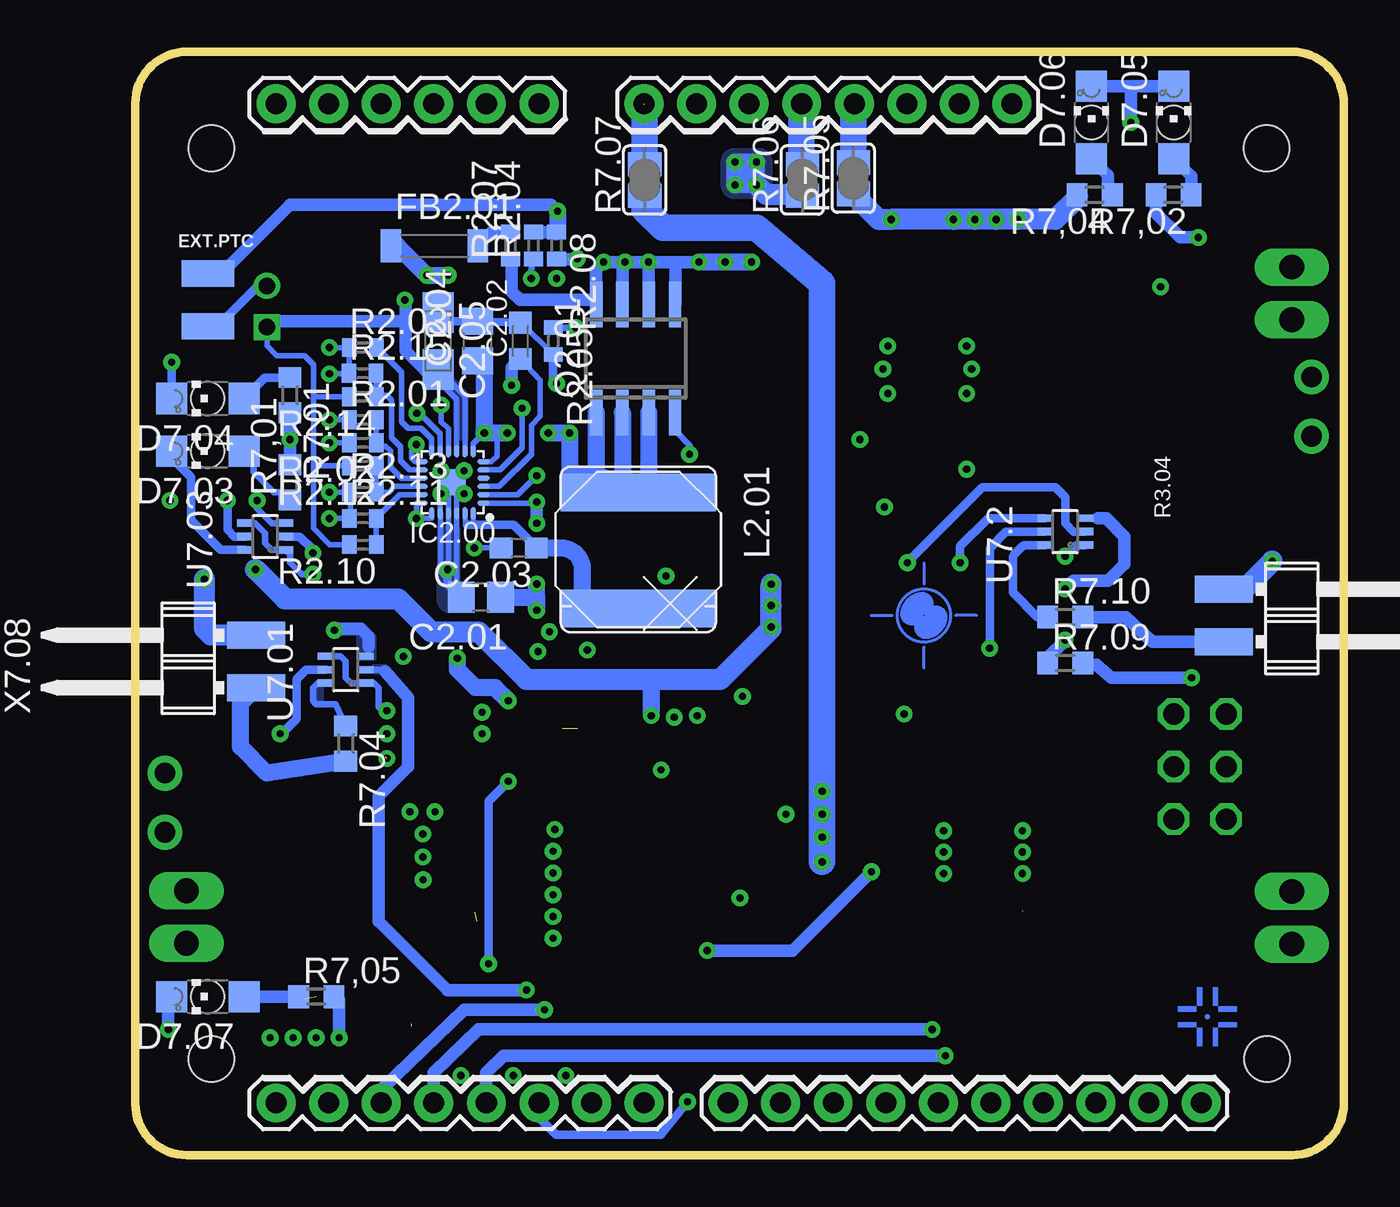
[diagram p9: board, bottom side, seen from below]

Size 58.4 x 53.3 mm. Coordinates in mm from the lower left corner, seen from the top.
Outline: 2.5,53.3 arc90 0,50.8 0,2.5 arc90 2.5,0 55.9,0 arc90 58.4,2.5 58.4,50.8 arc90 55.9,53.3 2.4,53.3
Copper layers (1*2+3*4+5*6+7*16): Top 0.035mm / dielectric 0.2mm / Route2 0.035mm / dielectric 0.15mm / Route3 0.035mm / dielectric 0.2mm / layer 4 0.035mm / dielectric 0.15mm / layer 5 0.035mm / dielectric 0.2mm / layer 6 0.035mm / dielectric 0.15mm / layer 7 0.035mm / dielectric 0.2mm / Bottom 0.035mm
Design rules "default *": minimum track width 6mil, minimum drill 0.25mm, track to track 6mil, track to pad 8mil, pad to pad 8mil, via to via 6mil, smd to smd 8mil, copper to edge 12mil, drill to drill 24mil, minimum pad ring 9mil, minimum via ring 9mil, stop-mask expansion 3mil, vias tented up to drill 0mil, thermal gap 12mil
Holes 2.2 mm at 3.72,4.65 54.72,4.65 3.74,48.64 54.72,48.64
Holes 1.6 mm at 8.23,49.88 12.2,49.88 54.9,36.55 54.9,34.01 54.9,7.66
Milling: 4 lines

### Footprints (pad centres in the part's own frame; a part is rotated, then mirrored left to right if it is on the bottom)
C1210K = smd 1.5 x 2.9: 1 -1.5,0; 2 1.5,0
C0402K = smd 0.925 x 0.74: 1 -0.6,0; 2 0.6,0
C1206K = smd 1.5 x 2: 1 -1.5,0; 2 1.5,0
C0805 = smd 1.3 x 1.5: 1 -0.95,0; 2 0.95,0
C0603K = smd 1.05 x 1.08: 1 -0.875,0; 2 0.875,0
C0603 = smd 1.1 x 1: 1 -0.85,0; 2 0.85,0
A/3216-18R = smd 1.95 x 1.5: + 1.375,0; - -1.375,0
C0402 = smd 0.7 x 0.9: 1 -0.65,0; 2 0.65,0
C/6032-28R = smd 2.55 x 2.5: + 2.525,0; - -2.525,0
C0805K = smd 1.3 x 1.6: 1 -1,0; 2 1,0
C-2312 = smd 1.3 x 2.2: N 2.032,0.022; P -2.108,0.022
SMC = smd 2.8 x 3.8: A 3.7,0; C -3.7,0
CHIPLED_1206 = smd 1.5 x 1.5: A 0,-1.75; C 0,1.75
R1210 = smd 1.6 x 2.7: 1 -1.4,0; 2 1.4,0
L4516C = smd 1 x 1.6: 1 -2.1,0; 2 2.1,0
SOIC-8-PAD = smd 1.27 x 0.6: 1 -2.4,1.905; 2 -2.4,0.635; 3 -2.4,-0.635; 4 -2.4,-1.905; 5 2.4,-1.905; 6 2.4,-0.635; 7 2.4,0.635; 8 2.4,1.905 | smd 2.55 x 3.7: PAD 0,0
VQFN-24 = smd 0.6 x 0.23: 1 -1.5,1; 2 -1.5,0.6; 3 -1.5,0.2; 4 -1.5,-0.2; 5 -1.5,-0.6; 6 -1.5,-1; 13 1.5,-1; 14 1.5,-0.6; 15 1.5,-0.2; 16 1.5,0.2; 17 1.5,0.6; 18 1.5,1 | smd 0.23 x 0.6: 7 -1,-1.5; 8 -0.6,-1.5; 9 -0.2,-1.5; 10 0.2,-1.5; 11 0.6,-1.5; 12 1,-1.5; 19 1,1.5; 20 0.6,1.5; 21 0.2,1.5; 22 -0.2,1.5; 23 -0.6,1.5; 24 -1,1.5 | smd 1.27 x 1.27: PAD 0,0
LGA-24 = smd 0.29 x 0.4: 1 -0.025,2.45; 6 -0.025,0; 7 0.405,0; 8 0.835,0; 9 1.264,0; 10 1.694,0; 11 2.124,0; 12 2.554,0; 13 2.985,0; 18 2.985,2.45; 19 2.554,2.45; 20 2.124,2.45; 21 1.694,2.45; 22 1.264,2.45; 23 0.835,2.45; 24 0.405,2.45 | smd 0.4 x 0.29: 2 -0.025,1.87; 3 -0.025,1.44; 4 -0.025,1.01; 5 -0.025,0.58; 14 2.985,0.58; 15 2.985,1.01; 16 2.985,1.44; 17 2.985,1.87
HSOP8 = smd 2.15 x 0.45: 1 -2.857,1.905; 2 -2.857,0.635; 3 -2.857,-0.635; 4 -2.857,-1.905; 5 2.857,-1.905; 6 2.857,-0.635; 7 2.857,0.635; 8 2.857,1.905 | smd 2.7 x 2.9: THERMAL 0,0
SJ_2 = smd 1.168 x 1.6: 1 -1.524,0; 2 0,0; 3 1.524,0
TAIYO-YUDEN.NRS8030T4R7MJGJ = smd 1.8 x 7.5: 1 -2.54,0; 2 3.06,0
SMD1,27-2,54 = smd 1.27 x 2.54: 1 0,0
SO-08 = smd 0.6 x 2.2: 1 -1.905,-2.6; 2 -0.635,-2.6; 3 0.635,-2.6; 4 1.905,-2.6; 5 1.905,2.6; 6 0.635,2.6; 7 -0.635,2.6; 8 -1.905,2.6
R0402 = smd 0.7 x 0.9: 1 -0.65,0; 2 0.65,0
R0805 = smd 1.3 x 1.5: 1 -0.95,0; 2 0.95,0
R0603 = smd 1 x 1.1: 1 -0.85,0; 2 0.85,0
M0805 = smd 1.3 x 1.6: 1 -0.95,0; 2 0.95,0
SJ = smd 1.168 x 1.6: 1 -0.762,0; 2 0.762,0
R1206 = smd 1.6 x 1.803: 1 -1.422,0; 2 1.422,0
R-PDSO-G16 = smd 0.4 x 1.2: 1 -2.275,-2.9; 2 -1.625,-2.9; 3 -0.975,-2.9; 4 -0.325,-2.9; 5 0.325,-2.9; 6 0.975,-2.9; 7 1.625,-2.9; 8 2.275,-2.9; 9 2.275,2.9; 10 1.625,2.9; 11 0.975,2.9; 12 0.325,2.9; 13 -0.325,2.9; 14 -0.975,2.9; 15 -1.625,2.9; 16 -2.275,2.9 | smd 2.31 x 2.31: PAD 0,0
SC70-6 = smd 0.35 x 0.8: 1 -0.65,-0.95; 2 0,-0.95; 3 0.65,-0.95; 4 0.65,0.95; 5 0,0.95; 6 -0.65,0.95
JST_S2B-PH-K-S(LF)(SN) = drill 0.8 square: 1 1,0 | drill 0.8: 2 -1,0
2POL254 = drill 1.2 long: 1 -1.27,0; 2 1.27,0
AU_PINS = drill 1.016 pad 1.88: 3.3V -8.89,-24.13; 5V -6.35,-24.13; ADC.0 6.35,-24.13; ADC.1 8.89,-24.13; ADC.2 11.43,-24.13; ADC.3 13.97,-24.13; ADC.4 16.51,-24.13; ADC.5 19.05,-24.13; AREF -20.574,24.13; GND2 -1.27,-24.13; GND3 -3.81,-24.13; GND.1 -18.034,24.13; I/OREF -13.97,-24.13; IO.0 19.05,24.13; IO.1 16.51,24.13; IO.2 13.97,24.13; IO.3 11.43,24.13; IO.4 8.89,24.13; IO.5 6.35,24.13; IO.6 3.81,24.13; IO.7 1.27,24.13; IO.8 -2.794,24.13; IO.9 -5.334,24.13; IO.10 -7.874,24.13; IO.11 -10.414,24.13; IO.12 -12.954,24.13; IO.13 -15.494,24.13; N/C -16.51,-24.13; RESET -11.43,-24.13; SCL -25.654,24.13; SDA -23.114,24.13; VIN 1.27,-24.13
M1X2_MALE_RIGHT_ANGLED_SMD = smd 1.3 x 2.8: 1 -1.27,-0.76; 2 1.27,-0.76
2X03/90 = drill 1.016 octagon: 1 -2.54,-6.35; 2 -2.54,-3.81; 3 0,-6.35; 4 0,-3.81; 5 2.54,-6.35; 6 2.54,-3.81
A0R-JMP = smd 1.5 x 1.3: 1 0,1.7; 2 0,0; 3 0,-1.7

### Placement (x,y rotation side)
C1.01  44.51,14.41 0 top
C1.02  41.09,26.07 90 top
C1.03  40.3,16.94 180 top
C1.04  43.95,26.07 90 top
C1.05  35.37,19.09 90 top
C1.06  37.75,19.09 90 top
C2.01  41.7,26.95 180 bottom
C2.02  39.79,39.33 90 bottom
C2.03  39.87,29.33 180 bottom
C2.04  41.86,39.33 90 bottom
C2.05  43.76,39.33 270 bottom
C3.01  36.88,30.2 90 top
C3.02  33.07,30.04 90 top
C3.03  31.96,30.04 90 top
C3.04  35.22,30.2 90 top
C3.05  32.52,26.71 180 top
C4.01  22.2,13.69 90 top
C4.02  21.24,19.17 90 top
C4.03  24.1,21.31 180 top
C4.04  18.7,19.72 180 top
C4.05  18.7,21.31 0 top
C6.01  23.39,32.9 90 top
C6.02  19.34,32.26 90 top
C6.03  19.18,42.74 0 top
C6.04  11.88,37.98 270 top
C6.05  15.37,37.98 270 top
D1.01  50.2,11.22 90 top
D7.03  54.9,34.01 90 bottom
D7.04  54.9,36.55 90 bottom
D7.05  8.23,49.88 0 bottom
D7.06  12.2,49.88 0 bottom
D7.07  54.9,7.66 90 bottom
F1.01  44.44,9.19 180 top
FB1.01  44.07,11.72 180 top
FB1.02  31.25,14.8 90 top
FB2.01  43.95,43.93 0 bottom
FB4.01  25.37,19.17 0 top
FB6.01  13.62,42.11 180 top
IC1.01  43.95,20.36 90 top
IC2.00  43.07,32.5 180 bottom
IC3.01  34.41,25.26 0 top
IC4.01  17.44,14.64 90 top
J4.01  12.35,10.2 90 top
L1.02  36.72,12.42 0 top
L2  61.64,18.02 90 top  (outside the outline)
L2.01  34.1,29.47 270 bottom
L6.01  13.78,29.41 180 top
NTC+  54.9,42.58 90 bottom
NTC-  54.9,40.04 270 bottom
Q2.01  34.23,38.48 0 bottom
R1.01  40.37,19.96 90 top
R1.02  42.2,26.07 270 top
R1.03  46.23,26.55 180 top
R1.04  46.23,25.42 0 top
R1.05  31.25,19.8 180 top
R1.06  31.25,18.61 0 top
R2.01  47.41,35.52 0 bottom
R2.02  47.41,34.41 180 bottom
R2.03  47.41,39.02 0 bottom
R2.04  39.16,43.94 90 bottom
R2.05  38.21,39.33 270 bottom
R2.07  40.27,43.94 90 bottom
R2.08  38.05,43.94 270 bottom
R2.10  47.41,29.49 180 bottom
R2.11  47.41,30.76 0 bottom
R2.12  47.41,33.3 180 bottom
R2.13  47.41,32.03 0 bottom
R2.14  47.41,36.63 180 bottom
R2.15  47.42,37.77 0 bottom
R3.01  37.91,22.82 270 top
R3.02  36.8,22.82 90 top
R3.03  31.25,22.82 270 top
R3.04  30.13,22.82 90 top
R3.05  33.47,22.82 270 top
R3.06  32.36,22.82 90 top
R3.07  34.58,22.82 270 top
R3.08  35.69,22.82 270 top
R4.03  21.88,8.93 180 top
R4.04  15.85,8.93 0 top
R4.05  18.86,8.93 180 top
R6.01  22.2,32.9 90 top
R6.02  24.26,35.76 180 top
R6.03  12.59,44.33 0 top
R6.04  21.88,43.61 90 top
R6.05  22.99,43.61 90 top
R7,01  50.93,32.5 90 bottom
R7,02  8.23,46.39 180 bottom
R7,04  12.04,46.39 180 bottom
R7,05  49.66,7.66 0 bottom
R7.01  50.93,36.71 270 bottom
R7.02  46.01,6.23 180 top
R7.03  41.88,6.23 180 top
R7.04  48.23,19.88 270 bottom
R7.05  23.71,47.19 90 bottom
R7.06  26.17,47.11 90 bottom
R7.07  33.79,47.11 90 bottom
R7.08  49.5,22.26 270 top
R7.09  13.47,23.77 0 bottom
R7.10  13.47,25.99 0 bottom
R7.11  5.05,36.15 270 top
R7.12  53.71,16.94 90 top
REF2  26.33,34.8 0 top
REF4  28.55,25.9 180 top
REF5  0.08,-0.15 0 top
U6.01  20.13,37.98 0 top
U7.01  48.23,23.45 90 bottom
U7.2  13.47,30.12 90 bottom
U7.03  52.12,29.88 90 bottom
U$3  [A4L-LOC]  -94.96,-63.15 0 top  (outside the outline)
U$5  [PASS-ROUND]  20.29,26.07 0 top
U$8  [PASSER-CIRCLE]  6.6,6.68 0 bottom
X2.01  52.04,40.99 270 top
X7.01  55.94,11.51 270 top
X7.02  32.55,26.65 180 bottom
X7.03  5.05,26.07 270 bottom
X7.04  2.51,41.63 270 top
X7.05  2.51,11.47 270 top
X7.06  5.05,26.07 90 top
X7.07  1.88,18.77 90 top
X7.08  53.31,23.85 90 bottom
X7.09  3.46,30.36 270 top
X7.10  55.06,30.2 90 top
X7.11  53.31,23.85 270 top

### Tracks (layer width: path | path; a pad name or v marks a point on that pad's centre or on a via)
!IRQ_GYRO  (via drill 0.35)
  Top 0.305: IC3.01.11 36.54,24.43 v36.56,24.41
  Route3 0.406: v36.56,24.41 36.64,24.48 36.64,23.77
  Route3 0.61: 36.64,23.77 arc-98 32.99,20.12 31.48,19.72 arc31 30.29,18.61 arc11 27.91,13.69 arc55 28.15,11.94 arc14 28.55,11.39 arc84 30.06,11.47 arc-56 31.01,11.71 arc-41 32.04,10.2 arc59 38.23,6.94 v38.63,7.02
  Bottom 0.61: v38.63,7.02 42.52,7.02 46.49,3.21 46.49,2.55 X7.02.IO.2
+3V3  (via drill 0.35)
  Top 0.254: C3.04.1 35.22,28.94 | IC3.01.23 35.25,28.01 | IC3.01.23 IC3.01.22 | C3.05.1 34.38,26.71 arc-90 IC3.01.3 34.89,26.7 35.25,27.06 IC3.01.23 | R3.01.2 38.61,22.17 38.87,22.42 38.87,24.17 v38.95,24.33
  Top 0.305: 35.25,28.01 35.25,29.07 arc90 C3.04.1 | IC3.01.1 33.34,27.71 v32.75,27.98
  Top 0.406: R3.03.2 31.25,21.24 | v31.25,21.23 31.25,21.16 28.7,21.16 28.15,21.71 28.15,25.04 v27.67,25.52 | 33.47,22.1 R3.05.2
  Top 0.61: R6.04.2 21.88,44.41 | 31.25,22.02 R3.03.2 | R3.05.2 R3.07.2 R3.08.2 | 53.31,30.15 arc-90 X7.10.1 | C3.03.1 31.96,28.45 32.44,27.98 v32.75,27.98
  Top 0.813: 21.88,44.41 v21.88,45.2 | v32.75,27.98 33.17,27.57 C3.05.1 | v31.25,21.23 31.25,21.24 31.25,22.02 | v52.6,28.3 53.31,29.01 53.31,30.15 X7.10.1 | 33.47,22.1 v33.47,21.23
  Top 1.016: X7.07.5 9.02,21.31 9.74,22.02 9.74,23.77 8.47,25.04 8.47,30.36 | 8.47,30.36 8.47,32.34 8.86,32.74 v8.86,41.95 | X7.09.1 8.47,30.36
  Top 1.27: X7.07.6 X7.07.5
  Route3 0.254: v38.95,24.33 arc-90 38.79,24.48 38.15,24.48 arc-90 37.36,25.12 arc110 v32.75,27.98
  Route3 0.61: v52.6,28.3 arc-90 51.49,29.01 51.49,33.93 arc90 v50.93,34.57
  Route3 1.016: v32.75,27.98 32.04,27.98 arc-90 27.67,32.26
  Route3 1.27: v27.67,25.52 v27.67,26.55 v27.67,27.58 27.67,32.26 27.67,40.04 arc90 v21.88,45.2 v18.86,45.2 v17.83,45.2 v16.8,45.2 v15.77,45.2 12.12,45.2 arc90 v8.86,41.95
  Bottom 0.61: R7.01.2 arc90 50.93,35.7 v50.93,34.57 R7,01.2
  Bottom 0.813: v33.47,21.23 33.47,22.74 33.63,22.98
  Bottom 1.016: v52.6,28.3 51.17,26.87 45.69,26.87 44.11,25.28 41.8,25.28 39.5,22.98 33.63,22.98 30.13,22.98 27.67,25.44 v27.67,25.52 v27.67,26.55 v27.67,27.58 | R7,04.2 12.89,46.26 13.94,45.2 v15.77,45.2 v16.8,45.2 v17.83,45.2 v18.86,45.2 v21.88,45.2 22.48,45.2 R7.05.1
+4.1V  (via drill 0.35)
  Top 0.305: 18.78,31.63 C6.02.1 | 16.32,31.63 L6.01.1 | U6.01.6 21.09,35.08 | 22.75,44.25 R6.05.2
  Top 0.406: R6.05.2 22.82,44.17 23.07,44.25 | 20.77,30.2 20.77,32.9 21.11,33.24 U6.01.6 | 23.88,32.17 23.47,32.17 C6.01.1 | R6.02.1 25.05,35.76 25.13,35.84
  Top 0.813: 16.32,31.63 18.78,31.63 20.21,30.2 20.77,30.2 22.91,30.2 24.38,31.67 | 23.07,44.25 25.13,44.25 | 25.13,44.25 25.13,35.84 25.13,32.42 24.38,31.67 | 23.88,32.17 24.38,31.67 | v31.17,43.14 v29.9,43.14 v28.63,43.14 27.52,44.25 25.13,44.25
  Route3 0.61: v45.38,41.31 45.45,42.66 arc90 44.34,43.69 38.55,43.69 arc-44 37.75,44.17 arc81 36.25,44.09 arc47 v35.77,43.14 v34.74,43.14 v33.6,43.14
  Bottom 0.254: R2.14.2 49.72,36.63 49.8,36.71 | 49.8,36.71 49.8,38.19 50.22,38.61 51.57,38.61 52.04,39.09 X2.01.1 | 49.8,36.71 49.8,33.3 | 49.8,33.3 R2.12.2 | R2.10.2 49,29.49 49.8,30.28 49.8,33.3 | IC2.00.9 42.87,36.51 43.71,37.34 43.71,37.9 C2.05.+ 42.47,36.67 IC2.00.8
  Bottom 0.305: 34.9,41.31 34.9,41.08 arc-180 Q2.01.7 | 36.01,41.31 36.01,41.08 Q2.01.8 | Q2.01.6 33.63,41.08 33.6,41.31
  Bottom 0.61: C2.05.+ 43.82,37.9 44.4,37.9 45.35,38.86 45.35,40.28 | R2.07.1 40.22,43.23 40.22,41.71 39.82,41.31 36.36,41.31 arc90 Q2.01.8 | 32.32,41.31 Q2.01.5 32.31,41.12 32.31,43.14 | 51.99,40.04 51.76,40.28 45.35,40.28 | v31.17,43.14 32.31,43.14 | 45.35,40.28 45.35,41.15 v45.38,41.31 | v33.6,43.14 32.31,43.14 | v34.74,43.14 v35.77,43.14 36.13,42.77 Q2.01.8 | v34.74,43.14 v33.6,43.14 | 33.6,41.31 v33.6,43.14 | Q2.01.7 34.86,43.14 v34.74,43.14
  Bottom 0.813: X2.01.1 51.99,40.04 | v28.63,43.14 v31.17,43.14
  pour Bottom (no thermals): 42.91,34.64 42.91,36.79 43.39,37.26 43.15,37.5 42.44,36.79 42.44,34.64
+5V  (via drill 0.35)
  Top 0.305: 7.35,44.25 7.35,44.17 7.35,44.09
  Top 0.406: v7.04,44.33 7.27,44.25 7.35,44.17
  Top 0.61: v32.99,18.61 R1.06.2 R1.05.1 | 7.04,43.85 v7.04,44.33
  Top 1.016: X7.09.3 1.77,31.67 2.51,32.42 6.16,32.42 7.04,33.3 7.04,43.85 | X7.10.3 56.73,30.36 v56.73,31.63
  Top 1.422: X7.04.1 4.73,42.9 6.16,44.33 v7.04,44.33 R6.03.1
  Route3 0.305: v32.99,18.61 32.83,18.61
  Route3 0.406: 28.86,47.5 v28.39,47.98 v29.42,47.98
  Route3 1.016: 45.22,31.63 arc-75 v49.03,34.41
  Route3 1.27: 45.22,31.63 arc-16 v44.82,30.76 | v32.99,18.61 arc42 36.33,19.56 arc17 38.47,21.79 arc-51 40.06,23.37 arc67 41.33,25.04 | 50.53,26.15 arc15 48.31,26.95
  Route3 1.422: 42.99,26.31 arc99 41.33,25.04 | v56.73,31.63 56.73,26.79 arc-110 50.53,26.15 | 48.31,26.95 arc17 45.45,26.71
  Route3 1.676: X7.04.1 arc-33 10.93,47.5 28.86,47.5 41.72,47.5 arc-90 47.52,41.71 46.57,36.79 arc-35 v44.82,30.76 44.82,30.52 arc42 45.69,28.22 arc-101 45.45,26.71 arc-43 42.99,26.31
  Bottom 0.254: R2.02.2 v49.03,34.41 | IC2.00.18 44.82,31.5 v44.82,30.76 44.07,30.76 IC2.00.19
  Bottom 0.406: 28.79,47.58 v28.39,47.98
  Bottom 0.61: R7,02.2 9.08,45.54 9.1,45.52 7.91,44.33 v7.04,44.33
  Bottom 0.813: v29.42,46.87 v29.42,47.98 v28.39,47.98 28.39,47.19 28.71,47.19 v29.42,46.87 | v28.39,46.87 v29.42,46.87
  Bottom 1.016: R7.06.1 26.21,46.39 27.91,46.39 28.47,46.95 28.94,47.5
  pour Route3: 27.83,47.98 arc-90 28.31,48.46 29.42,48.46 arc-90 29.9,47.98 29.9,46.87 arc-90 29.42,46.39 28.31,46.39 arc-90 27.83,46.87
  pour Bottom: 27.83,47.98 27.83,46.79 arc90 28.23,46.39 29.42,46.39 arc90 29.9,46.87 29.9,47.98 arc90 29.42,48.46 28.31,48.46 arc90
+12V  (via drill 0.35)  (1 unrouted)
  Top 0.813: D1.01.C 51.72,7.52 | 25.13,21.28 C4.03.1 | v25.21,14.17 v25.21,15.36 v25.21,16.47 v25.21,17.58 25.21,21.2 arc90 C4.03.1 | v49.66,5.67 49.66,6.86 49.66,7.66 | v50.77,5.67 50.77,7.5 | v51.88,5.67 51.09,7.5 | R7.02.1 47.22,6.63 | v48.55,5.67 49.26,7.1 | FB4.01.2 27.47,20.4 26.56,21.31 C4.03.1
  Top 1.016: R7.02.1 47.59,6.86 49.66,6.86 | F1.01.1 45.95,9.09 46.01,9.09 46.01,8.61 47.12,8.61 47.44,8.29 49.66,8.29 49.66,7.66
  Route3 1.27: v51.88,5.67 51.72,5.28 50.69,5.28 | v25.21,17.58 v25.21,14.17 arc56 28.23,9.72 arc-10 32.36,6.86 arc42 36.09,5.28 48.71,5.28 | v50.77,5.67 50.69,5.28 | 50.69,5.28 49.74,5.28 | v49.66,5.67 49.74,5.28 | 49.74,5.28 48.71,5.28 | v48.55,5.67 48.71,5.28
  Bottom 0.61: R7,05.2 48.55,7.5 v48.55,5.67
  Bottom 1.016: 33.79,45.84 R7.07.1
  Bottom 1.27: v25.21,14.17 v25.21,17.58 25.21,42.11 28.39,44.8 32.91,44.8 33.79,45.68 33.79,45.84
CAR.AUXILLARY  (via drill 0.35)
  Top 0.813: X7.02.IO.10 24.68,3.47 26.96,5.75 v26.96,16.47
  Route3 0.813: v26.96,16.47 26.96,17.74 arc61 v21.09,28.61
  Bottom 0.406: U7.2.2 13.07,30.12 13.47,30.52 13.47,31.79 13.94,32.26 17.46,32.26 21.01,28.72 v21.09,28.61
CAR.BLIGHT  (via drill 0.35)
  Top 0.406: v31.72,2.58 31.72,8.93 v30.77,9.88
  Route3 0.61: v22.83,13.69 20.69,16.55 arc-25 v17.12,24.48
  Bottom 0.406: X7.02.IO.5 38.9,1.82 38.07,0.99 32.99,0.99 v31.72,2.58 | U7.2.5 16.32,30.12 17.12,29.33 v17.12,24.48
  Bottom 0.61: v22.83,13.69 26.64,9.88 v30.77,9.88
CAR.FLIGHT  (via drill 0.35)
  Top 0.61: v39.5,7.97 38.07,7.97 36.36,6.26 X7.02.IO.6
  Bottom 0.305: 46.33,23.37 46.41,23.45 U7.01.2
  Bottom 0.61: v39.5,7.97 43.31,7.97 46.64,11.31 46.64,11.47 46.64,17.34 45.22,18.77 45.22,22.1 46.33,23.37
  pour Bottom (no thermals): 46.33,23.53 46.33,23.21 46.49,23.37 46.8,23.37 46.88,23.53
CAR.GATECTLR  (via drill 0.35)
  Top 0.61: X7.02.IO.9 27.22,3.15 29.18,5.12 v29.18,12.42
  Route3 0.61: v51.41,20.36 arc-90 49.19,18.13 48.79,17.98 arc-44 44.82,17.98 arc12 43.23,18.61 arc4 40.69,19.25 arc51 38.31,18.69 arc0 v29.18,12.42
  Bottom 0.406: v51.41,20.36 51.33,20.36 50.61,21.07 50.61,22.98 50.14,23.45 U7.01.5
CAR.LAPCNT
  Route3 1.016: X7.07.1 arc90 15.21,9.24 22.52,9.24 arc-42 X7.02.IO.7
CAR.SPEED
  Route3 1.016: X7.07.2 arc90 13.7,6.78 15.77,6.7 arc33 18.78,7.18 arc-99 21.4,6.63 arc51 23.47,5.12 arc15 27.83,4.88 arc-90 29.76,2.96 X7.02.IO.8
GND  (via drill 0.35, 0.35 pad 0.6, 1 pad 1.68)  (3 unrouted)
  Top 0.254: IC3.01.20 IC3.01.19 IC3.01.18 IC3.01.17 IC3.01.16 IC3.01.15 IC3.01.14
  Top 0.305: C1.02.2 41.41,26.72 R1.02.1 42.22,26.72 | R1.04.1 45.45,25.29 v45.45,24.09 | 37.91,28.22 IC3.01.18 | 37.83,25.83 37.83,25.84 IC3.01.14
  Top 0.406: C6.01.2 23.39,33.77 | C6.02.2 19.6,33.64 | 19.6,33.64 19.81,34.06 U6.01.4 19.81,37.98 U6.01.PAD | U6.01.5 20.46,37.98 20.45,37.98 | 20.45,37.98 U6.01.PAD | 20.29,37.9 20.37,37.9 20.45,37.98 | U6.01.PAD 21.11,38 U6.01.11 21.11,41.74 20.11,42.74 C6.03.2 | 20.77,38.85 20.77,37.98 U6.01.PAD | 19.82,37.82 19.82,37.98 19.5,37.98 19.5,38.53 arc-90 19.82,38.85 | v18.23,36.79 16.88,36.79 16.09,35.99 C6.05.N C6.04.N | C4.03.2 v21.24,21.31 | v21.24,21.31 C4.05.2 | C4.02.2 v21.24,21.31 | IC4.01.7 16.8,15.28 | IC4.01.1 v15.53,13.61 | v38.39,25.28 37.83,25.83 | 20.46,34.71 20.46,33.7 19.9,33.22 18.23,33.22 | 22.2,31.95 R6.01.1 | 19.16,37.05 U6.01.3 19.16,34.09 19.6,33.64 | R3.04.1 29.31,22.17 v29.06,22.16 | 35.22,30.84 C3.04.2 35.22,31.95 | 33.07,31.95 32.75,31.95 31.96,31.15 C3.03.2 31.95,30.68 31.33,30.68 30.93,30.28 30.93,27.1 31.33,26.71 C3.05.2 | 33.07,31.95 35.22,31.95 | C3.02.2 33.07,31.95 | C3.01.2 36.88,31.95 | 36.88,31.95 35.22,31.95 | 37.91,28.22 37.91,31.55 37.52,31.95 36.88,31.95
  Top 0.61: C1.01.2 45.85,15.23 46.06,15.23 46.17,15.12 46.17,17.96 | 45.22,19.72 44.64,20.01 IC1.01.PAD | 37.04,20.59 36.64,20.59 | 36.64,20.59 C1.05.2 | C1.05.2 35.21,20.59 35.17,20.63 35.49,20.63 C1.05.2 | 32.36,22.26 R3.06.1 | 45.22,19.48 45.17,19.48 | v32.36,21.15 32.36,20.91 33.15,20.12 35.06,20.12 C1.05.2 | 18.7,13.61 20.29,13.69 21.24,12.74 21.24,12.12 C4.01.- arc-90 22.53,10.83 R4.03.1 22.52,8.91 22.52,8.29 21.88,7.66 20.29,7.66 19.51,8.44 R4.05.1 | v17.99,37.98 19.81,37.98 | v22.28,37.98 20.77,37.98 | v22.04,39.09 U6.01.PAD | v18.23,39.09 U6.01.PAD | v18.23,36.79 U6.01.PAD | 16.8,15.28 17.05,15.53 17.05,15.6 | 15.52,11.78 15.52,9.86 15.21,9.56 15.21,8.94 R4.04.1 14.94,8.67 J4.01.1 | v43.31,28.3 43.31,27.83 R1.02.1 | R3.02.1 36.8,21.71 36.64,21.55 36.64,20.59 | 45.85,19.33 46.33,19.25 46.17,19.09 46.17,17.96 | 46.17,17.96 IC1.01.4 | v22.04,36.79 20.37,37.66 19.82,37.82
  Top 0.813: v22.2,31.31 22.2,31.95 | 23.39,33.77 v23.39,34.57 | C6.02.2 18.89,33.14 v18.23,33.14 | v32.36,21.15 32.36,22.26 | 45.17,19.48 44.64,20.01 | 45.22,19.48 45.22,20.36 v46.25,20.36 44.9,20.36 44.9,21.23 | 43.15,21.23 43.15,20.36 v41.64,20.36 42.99,20.36 42.99,19.48 | v15.53,14.64 16.8,14.64 | v15.53,13.61 17.44,13.69 | v19.34,15.67 17.75,15.59 17.75,14.96 arc-90 IC4.01.THERMAL | v19.34,14.64 IC4.01.THERMAL | v19.34,13.61 18.7,13.61 17.44,13.69 | 17.44,13.69 IC4.01.THERMAL | v40.14,3.85 40.14,6.23 R7.03.2 | v42.68,3.85 42.68,4.64 37.6,4.64 v37.6,3.85 | v15.53,15.67 17.05,15.6 17.28,15.59 IC4.01.THERMAL | v41.64,21.39 IC1.01.PAD v46.25,21.47 | v46.25,19.17 43.95,20.28
  Top 1.016: 16.8,14.64 IC4.01.THERMAL | R7.11.2 2.12,34.73 | 2.12,34.73 2.12,34.72 | 2.12,34.73 1.56,34.73 v1.56,34.72
  Top 1.27: X7.02.GND2 X7.02.GND3
  Top 1.676: R7.12.2 53.64,18.45 v56.96,18.45 | v46.25,20.36 48.15,18.45 53.31,18.45
  Bottom 0.254: 42.85,32.35 IC2.00.PAD | C2.01.2 43.25,27.65 | C2.01.2 42.85,27.25 | 43.14,27.49 43.65,28.21 43.65,31 IC2.00.20 43.67,31.9 v43.63,31.95 43.47,32.1 | 43.14,27.49 C2.01.2 | R2.05.2 38.19,38.68 C2.02.2 | R2.15.1 48.07,39.01 R2.03.1 v49.03,39.01 | 47.92,37.77 R2.15.1 | R2.15.1 48.07,37.74 v49.03,37.74 | R2.13.1 47.99,31.95 | R2.11.1 v49.03,30.76 | 47.99,31.95 47.99,30.76 | 47.99,31.95 47.99,32.03 v49.03,32.03 | C2.01.2 42.87,27.17 IC2.00.22 42.87,32.3 IC2.00.PAD | 43.47,32.1 43.31,32.26 | 43.47,32.1 43.27,32.1 IC2.00.21 | 43.27,32.5 IC2.00.PAD | IC2.00.21 43.27,27.62 arc-90 43.14,27.49 | IC2.00.21 43.27,27.7 arc-90 42.91,27.34 | R2.01.1 v49.02,35.52 v49.03,35.52
  Bottom 0.305: U7.03.4 52.61,30.53 52.12,30.04 52.12,29.56 51.8,29.25 51.19,29.25 U7.03.1 50.93,28.99 50.93,28.61 50.38,28.06 v49.82,28.06 | v46.25,21.47 46.64,21.63 46.64,22.58 46.87,22.8 U7.01.1 47.98,22.8 48.23,23.06 48.23,23.85 48.49,24.1 U7.01.4
  Bottom 0.406: C2.02.2 C2.04.2 43.34,40.28 C2.05.- | NTC-.1 54.42,40.04 52.47,41.99 X2.01.2 | C2.01.2 43.31,27.61 v43.31,28.3 | U7.2.1 12.93,29.47 v13.47,28.93 | U7.2.4 17.18,30.77 18.55,29.41 v18.55,28.61 | v38.05,37.27 38.21,37.43 R2.05.2
  Bottom 0.61: R2.08.2 37.21,43.29 v37.04,43.3 | D7.06.C 10.29,51.63 | 10.29,51.63 D7.05.C | v10.29,49.88 10.29,51.63 | v56.8,6.07 56.8,7.18 D7.07.C
  other vias: 43.63,33.06 42.52,33.06 42.52,31.95
  pour Route2 (no thermals): -0.9,54.09 0.05,-0.2 58.47,-0.44 59.03,53.38
  pour Bottom (no thermals): 43.71,30.28 43.71,26.87 arc-90 43.15,26.31 42.12,26.31 42.12,27.58 42.83,27.58 42.83,30.28
  pour Top (no thermals): 20.45,34.41 20.45,33.69 19.66,32.9 18.23,32.9 arc-90 17.99,33.14 arc-106 18.39,33.38 19.34,34.41
GNDA  (via drill 1 pad 1.68)
  Top 0.305: R7.12.1 53.78,15.59 53.79,15.59
  Top 1.676: 56.09,12.78 X7.01.1 55.94,15.59 | v56.96,15.59 55.94,15.59 | 53.62,15.59 53.79,15.59 55.94,15.59
IC2.0.!CHG  (via drill 0.35)
  Top 0.406: v44.82,34.33 45.3,33.85 46.17,33.85 47.76,32.26 47.76,30.36 49.03,29.09 v49.82,29.09
  Bottom 0.254: IC2.00.13 44.87,33.5 45.06,33.69 45.06,34.01 v44.82,34.33
  Bottom 0.406: U7.03.2 50.45,29.88 49.82,29.25 v49.82,29.09
IC2.0.!PG  (via drill 0.35)
  Top 0.406: v43.63,36.23 44.42,37.03 45.53,37.03 47.12,35.44 47.12,34.33 48.23,33.22 52.36,33.22 v53.95,31.63
  Bottom 0.254: IC2.00.10 43.27,35.08 43.63,35.44 v43.63,36.23
  Bottom 0.406: v53.95,31.63 53.95,30.2 53.63,29.88 U7.03.5
LBO
  Top 0.305: X7.02.ADC.0 38.87,50.75 | 21.66,42.96 21.72,42.9 | U6.01.10 21.76,42.84 R6.04.1
  Top 0.406: R6.04.1 21.66,42.96 20.45,44.17 20.45,47.82 21.72,49.09 37.28,49.09 38.9,50.71 X7.02.ADC.0
MOT.IN1  (via drill 0.35)
  Top 0.61: IC4.01.3 18.07,9.07 R4.05.2 18.23,8.91 18.23,7.74 v19.9,6.07
  Bottom 0.61: v19.9,6.07 41.8,6.07 43.98,3.97 X7.02.IO.3
MOT.IN2  (via drill 0.35)
  Top 0.406: IC4.01.2 16.81,11.78
  Top 0.61: 16.81,11.78 16.81,9.24 R4.04.2 16.5,7.56 v19.26,4.8
  Bottom 0.61: v19.26,4.8 40.61,4.8 41.44,3.97 X7.02.IO.4
N$1
  Top 0.254: IC3.01.21 36.11,28.08 36.41,28.37 36.64,28.37 36.88,28.61 C3.01.1
N$2
  Bottom 0.305: R7.04.1 48.72,21.79 49.66,21.79 49.82,21.95 49.82,22.58 49.6,22.8 U7.01.6
  pour Bottom (no thermals): 49.5,22.74 49.5,21.95 49.66,22.1 49.66,22.26 49.66,22.58
N$3
  Bottom 1.016: 23.71,48.54 R7.05.2
  Bottom 1.27: X7.02.3.3V 23.71,50.73 23.71,48.54
N$4
  Bottom 0.61: X7.02.5V 26.17,50.75
  Bottom 1.016: R7.06.2 26.17,48.3
  Bottom 1.27: 26.17,48.3 26.2,48.33 X7.02.5V
N$5  (1 unrouted)
  Bottom 1.016: 33.79,48.54 R7.07.2
  Bottom 1.27: 33.79,50.75 33.79,48.54
N$6
  Top 0.254: C3.02.1 34.17,28.3 34.66,28.3 34.82,28.14 IC3.01.24
  Top 0.305: C3.02.1 33.07,29.33
N$7  (via drill 0.35)
  Top 0.61: v48.79,25.36 49.5,24.64 R7.08.1
  Bottom 0.61: v48.79,25.36 48.71,25.44 47.52,25.44 47.12,25.04 47.12,24.56
  pour Bottom (no thermals): 46.88,24.09 46.88,25.04 47.44,25.6 48.63,25.6 48.79,25.44 48.79,25.28 48.71,25.2 47.68,25.2 47.6,25.12 47.6,24.09 47.6,24.01 46.88,24.01
N$8  (via drill 0.35)
  Top 0.61: v39,27.59 v39,30.52 v39,31.55
  Top 0.813: v39,27.59 v39,26.32
  Bottom 0.254: v39,31.55 v39,31.55 arc90 39.05,31.5 IC2.00.1
  Bottom 0.61: v39,31.55 v39,30.52
  Bottom 0.813: v39,27.59 v39,26.32 39,26.95 C2.01.1
N$9
  Top 0.813: J4.01.2 11.08,10.2
  Top 1.422: 11.08,10.2 X7.05.2
N$10
  Top 0.305: C4.04.1 arc90 19.34,19.48 19.34,18.45 arc90 19.5,18.29 C4.02.1
  Top 0.406: IC4.01.5 19.34,18.45
  Top 0.813: C4.02.1 22.67,18.29 | C4.01.+ 22.67,16.21 22.67,18.29 | 22.67,18.29 23.27,18.89 FB4.01.1
N$11
  Bottom 0.254: R2.01.2 R2.02.1 46.61,34.25 46.3,34.25 46.06,34.02 46.06,33.22 45.55,32.7 IC2.00.15
N$12
  Bottom 0.254: IC2.00.23 42.45,30.4 42.33,30.44 42.05,30.41 IC2.00.24
  Bottom 0.406: C2.03.1 39.26,29.59 40.11,30.44 42.33,30.44
  Bottom 0.813: C2.03.1 37.91,29.33 arc90 36.8,28.38 36.8,26.47 34.1,26.47 L2.01.2
N$13  (via drill 0.35)
  Top 0.254: v39,32.82 40.11,32.82 42.02,30.92 v42.02,29.33
  Bottom 0.254: C2.03.2 v42.02,29.33 | IC2.00.2 39.92,31.9 v39,32.82
N$14  (via drill 0.35)
  Top 0.406: v31.62,33.86 42.05,33.86 42.6,34.41 43.31,34.41 44.64,35.73 v44.8,35.84
  Bottom 0.254: IC2.00.11 43.67,34.85 44.58,35.76 44.72,35.76 v44.8,35.84
  Bottom 0.305: 32.33,35.87 32.28,35.81 32.28,34.96 31.62,34.3 v31.62,33.86
  Bottom 0.406: 32.33,35.87 Q2.01.4
N$15  (via drill 0.35)
  Top 0.305: 38.05,39.96 38.05,38.7 38.31,38.46 39.18,37.66 39.18,36.61 v39.72,36.08 | 38.05,39.96 v38.05,42.35 38.05,45.31 v37.99,45.6 | v37.12,39.96 38.05,39.96
  Bottom 0.254: IC2.00.5 40.79,33.1 39.72,34.17 v39.72,36.08
  Bottom 0.305: R2.05.1 38.03,39.96 v37.12,39.96
  Bottom 0.61: R2.08.1 R2.04.2 | NTC+.1 54.58,42.9 53.95,42.9 50.93,45.92 38.31,45.92 v37.99,45.6
  Bottom 0.813: v37.99,45.6 37.99,44.64 R2.08.1
N$16
  Bottom 0.61: FB2.01.2 41.19,44.59 R2.07.2
N$17
  Top 0.254: R3.02.2 R3.01.1 37.4,23.98 IC3.01.13
N$18  (via drill 0.35)
  Top 0.813: v38.44,34.89 v37.41,34.89 v41.54,34.89 41.54,37 43.15,38.61 43.15,42.37 v43.29,42.51 v44.32,42.51
  Bottom 0.254: IC2.00.7 42.07,34.36 v41.54,34.89 | IC2.00.6 41.2,33.5 40.93,33.77 40.93,34.89 v40.43,34.89
  Bottom 0.813: Q2.01.1 36.13,32.89 | 36.13,32.89 L2.01.1 | Q2.01.3 33.59,32.89 L2.01.1 | Q2.01.2 34.86,32.89 L2.01.1 | C2.04.1 41.55,37.98 41.55,34.89 v41.54,34.89 v40.43,34.89 | 36.13,32.89 37.41,32.89 v37.41,34.89 v38.44,34.89 | v43.29,42.51 v44.32,42.51 45.74,43.93 FB2.01.1
N$19
  Bottom 0.254: IC2.00.12 44.07,34.61 44.58,35.12 45.22,35.12 45.53,35.44 45.53,37.82 46.73,39.02 R2.03.2
N$20
  Bottom 0.254: R2.10.1 R2.11.2 45.62,31.9 IC2.00.17
N$21
  Bottom 0.254: R2.12.1 R2.13.2 46.14,32.03 45.87,32.3 IC2.00.16
N$22
  Bottom 0.254: R2.15.2 R2.14.1 46.69,36.71 46.25,36.71 46.01,36.47 46.01,34.64 45.59,34.22 45.59,33.54 45.15,33.1 IC2.00.14
N$23
  Top 0.254: IC3.01.5 34.03,25.84 32.83,24.64 31.56,24.64 31.25,24.33 R3.03.1 R3.04.2
N$24
  Top 0.254: IC3.01.7 34.82,24.56 34.58,24.33 R3.07.1
N$25  (via drill 1 pad 1.68)
  Top 1.016: R7.11.1 2.51,37.57 | 2.51,37.57 X7.04.2 | 2.51,37.57 v1.56,37.57 v1.56,37.58
N$26
  Top 0.254: IC3.01.6 33.47,24.34 R3.05.1 R3.06.2
N$27
  Top 0.254: IC3.01.8 35.25,24.61 35.53,24.33 35.53,23.63 R3.08.1
N$28
  Bottom 0.406: U7.03.6 53.09,29.25 54.27,29.25 55.69,30.68 55.69,32.74 56.33,33.38 56.33,33.69 D7.03.C
N$29
  Bottom 0.305: R7,01.1 51.41,32.03 51.72,32.03 52.68,32.98 52.68,33.69
  Bottom 0.406: 52.68,33.69 52.99,34.01 D7.03.A
N$30
  Bottom 0.406: R7.01.1 52.14,37.56 D7.04.A
N$31  (via drill 0.35)
  Route3 0.406: v56.65,38.3 54.11,38.3 arc90 52.52,36.87 v52.52,31.63
  Bottom 0.254: 52.52,31.55 v52.52,31.63
  Bottom 0.305: 52.44,31.63 v52.52,31.63 52.52,31.23 51.8,30.52 51.19,30.52 U7.03.3
  Bottom 0.406: D7.04.C 56.65,38.21 v56.65,38.3
N$32
  Bottom 0.61: R7,02.1 7.38,47.29 D7.05.A
N$33
  Top 0.406: C4.05.1 C4.04.2 | 18.15,19.72 C4.04.2 | 17.28,20.36 17.83,19.8 C4.04.2 | IC4.01.6 18.07,19.72 C4.04.2
  Top 1.422: X7.05.1 9.5,12.74 11.08,14.32 11.08,16.87 14.58,20.36 17.28,20.36
N$34
  Top 0.406: 14.89,17.5 IC4.01.8
  Top 1.27: J4.01.3 13.62,12.99 13.62,16.23 14.89,17.5
  pour Top (no thermals): 14.89,17.98 15.53,17.98 15.53,16.71 14.26,16.71 14.26,17.34
N$35
  Top 0.406: IC4.01.4 19.34,10.67 21.09,8.93 R4.03.2
N$36
  Top 1.016: FB6.01.2 12.59,42.11 13.55,43.06 R6.03.2
N$37
  Top 0.406: U6.01.9 22.41,41.37 22.99,41.95 R6.05.1
N$38
  Bottom 0.61: D7.06.A 11.4,47.34 11.4,46.87 11.19,46.65 R7,04.1
N$39
  Top 0.305: 17.91,35.08 U6.01.1 17.86,34.49 | L6.01.2 10.93,29.72
  Top 0.406: 17.86,34.49 17.22,34.25 17.36,34.01 18.07,34.01 18.51,34.45 U6.01.2
  Top 1.016: 17.22,34.25 11.96,34.25 10.72,33.01 L6.01.2
  pour Top: 18.07,34.17 18.39,34.49 18.07,34.49 17.75,34.17
N$40
  Top 0.406: U6.01.7 21.76,33.99 R6.01.2
N$41
  Top 0.305: R6.02.2 22.41,35.76 U6.01.8
N$42
  Bottom 0.813: R7.04.2 52.05,18.46 53.31,19.72 53.31,21.82 X7.08.1
N$43
  Top 0.305: C6.05.P C6.04.P | C6.03.1 17.75,42.74 | U6.01.14 19.16,41.45 19.18,41.47 18.86,41.79 | 18.86,41.79 18.51,41.79 | U6.01.13 19.82,41.47 19.5,41.79 18.86,41.79
  Top 0.406: C6.03.1 18.51,42.56 18.51,41.79 U6.01.15
  Top 1.016: C6.05.P 15.72,40.09 FB6.01.1 15.96,42.34 16.56,42.34 16.96,42.74 17.75,42.74
  pour Top (no thermals): 18.55,41.47 19.66,41.47 19.5,41.63 18.55,41.63
N$44
  Bottom 0.61: D7.07.A R7,05.1
N$45  (via drill 0.35)
  Top 1.016: X7.10.2 v55.06,27.82 55.06,25.44 54.74,25.12 X7.11.1
  Bottom 1.016: X7.11.1 54.74,25.12 55.06,25.44 v55.06,27.82
N$46  (via drill 0.35)
  Top 0.61: 5.34,24.52 X7.06.1 6.16,24.8 6.16,23.69 6.8,23.06 v7.35,23.06
  Bottom 0.61: R7.09.2 11.96,23.69 11.24,23.06 v7.35,23.06
N$47  (via drill 0.35)
  Route3 0.61: v13.47,27.34 v13.47,24.88
  Bottom 0.305: U7.2.3 12.52,30.76 11.88,30.76
  Bottom 0.61: 11.88,30.76 11.48,30.76 10.61,29.88 10.61,28.53 11.4,27.74 13.07,27.74 v13.47,27.34 | v13.47,24.88 14.32,24.03 R7.09.1
N$48  (via drill 0.35)
  Top 1.016: X7.09.2 v3.46,28.69 4.81,27.34 X7.03.1
  Bottom 1.016: X7.03.1 4.81,27.34 v3.46,28.69
N$50
  Top 0.813: R7.08.2 49.81,21.15 50.45,21.15 51.88,22.58 X7.11.2
N$51
  Bottom 0.406: U7.2.6 15.38,29.47 arc-45 15.53,29.41 15.91,29.02 arc-45 16.01,28.8 16.01,27.18 14.82,25.99 R7.10.1
N$52
  Bottom 0.61: X7.03.2 6.05,24.56 6.29,24.8 9.26,24.8 10.53,25.99 R7.10.2
N$80
  Top 1.016: F1.01.2 43.31,9.46 43.31,10.04 45,11.72 FB1.01.1
N$81  (via drill 0.35)  (1 unrouted)
  Top 0.203: IC1.01.2 43.31,18.21
  Top 0.61: 43.32,13.49 43.32,13.69 C1.01.1 42.87,14.86 42.87,17.13 43.31,17.57 IC1.01.2 | R1.01.1 v40.37,18.06 | v41.33,9.24 41.33,10.75 41.88,11.31
  Top 1.016: FB1.01.2 43.01,12.76 C1.01.1
  Bottom 0.406: v40.37,18.06 41.33,17.1 v41.33,9.24
N$82  (via drill 0.35)
  Top 0.305: IC1.01.7 43.31,23.53 v42.83,24.01
  Top 0.61: R1.01.2 v40.37,21.95
  Bottom 0.813: v40.37,21.95 41.01,22.58 41.96,22.58 42.83,23.45 v42.83,24.01
N$83
  Top 0.305: IC1.01.8 41.86,23.39 41.09,24.17 C1.02.1
N$84
  Top 0.305: C1.04.2 43.44,26.67 43.15,26.39 43.15,25.6 42.99,25.44 42.37,25.44 R1.02.2
N$85
  Top 0.305: C1.04.1 43.95,24.17 44.58,23.53 IC1.01.6
N$86
  Top 0.305: R1.03.1 R1.04.2 46.88,23.93 45.87,22.91 45.87,22.76
  Top 0.406: IC1.01.5 45.87,22.76
N$87
  Top 0.305: C1.06.1 37.67,17.66 38.07,17.66 39.34,18.93 39.34,23.14 40.14,23.93 40.14,27.34 40.93,28.3 42.2,28.3 43.07,29.17 44.18,29.17 45.53,27.82 45.53,26.6 R1.03.2 45.58,26.82
  Top 0.61: C1.06.1 C1.05.1 | 35.69,17.43 C1.05.1 | 35.38,17.43 C1.05.1
  Top 1.016: C1.05.1 35.37,16.39 34.58,15.59 arc90 34.18,15.2 L1.02.1 arc90 33.9,12.7 FB1.02.1
N$88  (via drill 0.35, 0.35 pad 0.6)
  Top 0.305: 40.3,12.58 40.61,12.42 L1.02.2
  Top 0.406: v38.13,15.73 39.66,15.73 40.01,15.73
  Top 0.61: v38.13,15.73 v38.21,14.68 v38.21,13.63 v38.21,12.58 | v38.21,12.58 v38.21,11.53 v38.21,10.48 | v38.21,12.58 40.3,12.58 | v45.13,16.59 v43.92,16.59 44.51,16.59 44.51,17.14 44.58,17.26 IC1.01.3 | 44.5,13.37 v44.5,14.4 v44.5,15.52 44.5,16.55 | C1.03.2 39.66,16.91 39.66,15.73
  other vias: 44.49,13.3
  pour Route3 (no thermals): 38.15,15.75 38.15,10.44 38.47,10.44 arc45 44.03,12.82 arc53 44.74,13.61 45.14,16.63 43.87,16.63 arc27 43.31,16.39 arc-19 39.26,15.75
N$89
  Top 0.61: C1.03.1 40.97,16.87 41.41,16.87 42.04,17.5 IC1.01.1
N$90
  Top 0.305: R1.06.1 R1.05.2
  Top 0.61: FB1.02.2 30.89,16.9 30.6,17.2 R1.06.1
RAILS.RX  (1 unrouted)
  Top 0.406: X7.02.IO.0 51.6,3.65 50.45,4.8 46.01,4.8 45.06,5.75 45.06,6.34 | R7.03.1 42.83,6.35
  Top 1.016: 42.83,6.35 42.95,6.23 R7.02.2
V+  (via drill 0.35)
  Route3 0.813: v39.26,42.34 arc90 40.14,40.04 arc-96 40.61,37.66 v40.22,37.18
  Bottom 0.254: C2.02.1 38.84,37.43 38.84,35.68 39.26,35.26 39.26,33.85 40.81,32.3 IC2.00.3
  Bottom 0.305: v39.26,42.34 39.26,43.29 R2.04.1 | C2.02.1 39.79,38.32
  Bottom 0.61: v40.22,37.18 40.22,38.04 C2.02.1
VCC/2
  Top 1.676: X7.01.2 54.23,10.24 50.69,13.77 D1.01.A

### Text on the board
tNames: +5V | +3V3 | + | SHUNT | SHUNT
bNames: EXT.PTC
Milling: EAGLE EDU LIMIT
Document: GROUND POURS | RAILS POURS | TEST COUPON on PANELIZING / -> include layer indicator and fiducial marks / -> can include spare headlight / -> even a I2C or decatron knightrider / blinkenlight would be an option here | KITT-MB01 PCB LAYOUT | D.Hoeginger/A.Gessler | Kit for Intelligent and / Trainable Trackcars
Reference: SPEEDBOARD --> / LAPDETECTOR --> | Motor Leads --> | <-- Rail Power Leads | TODO: / COMMAND/BOTTOM LIGHT!!!
tDocu: SoC Supply --> | <-- Battery Pak | Tail Light --> | AUX OUT --> | <-- Head Light | <-- Gate Control IR | SpeedBoard--> / Lap Detector-->